# EAGLE board Mk3 Prototype2 (EAGLE 6.6.0), part 1 of 2
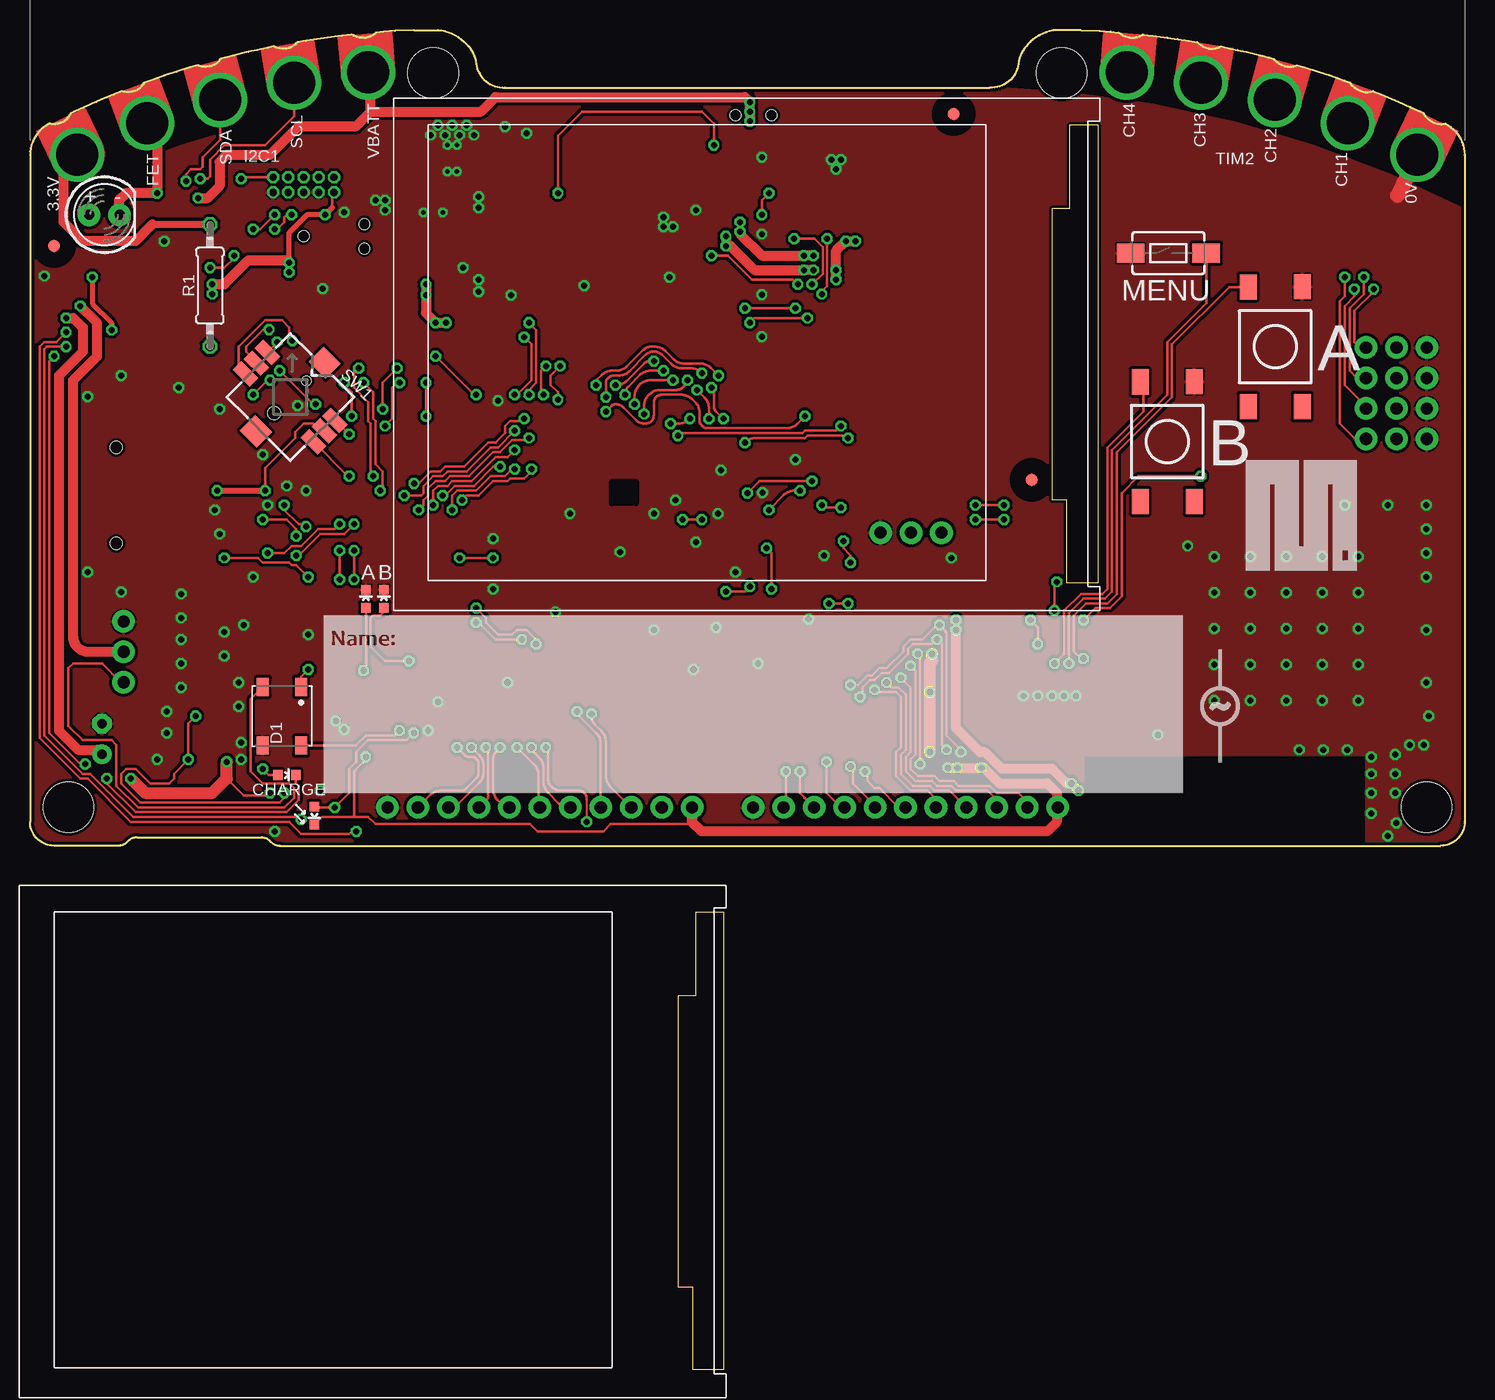
[diagram p2: board, top side]
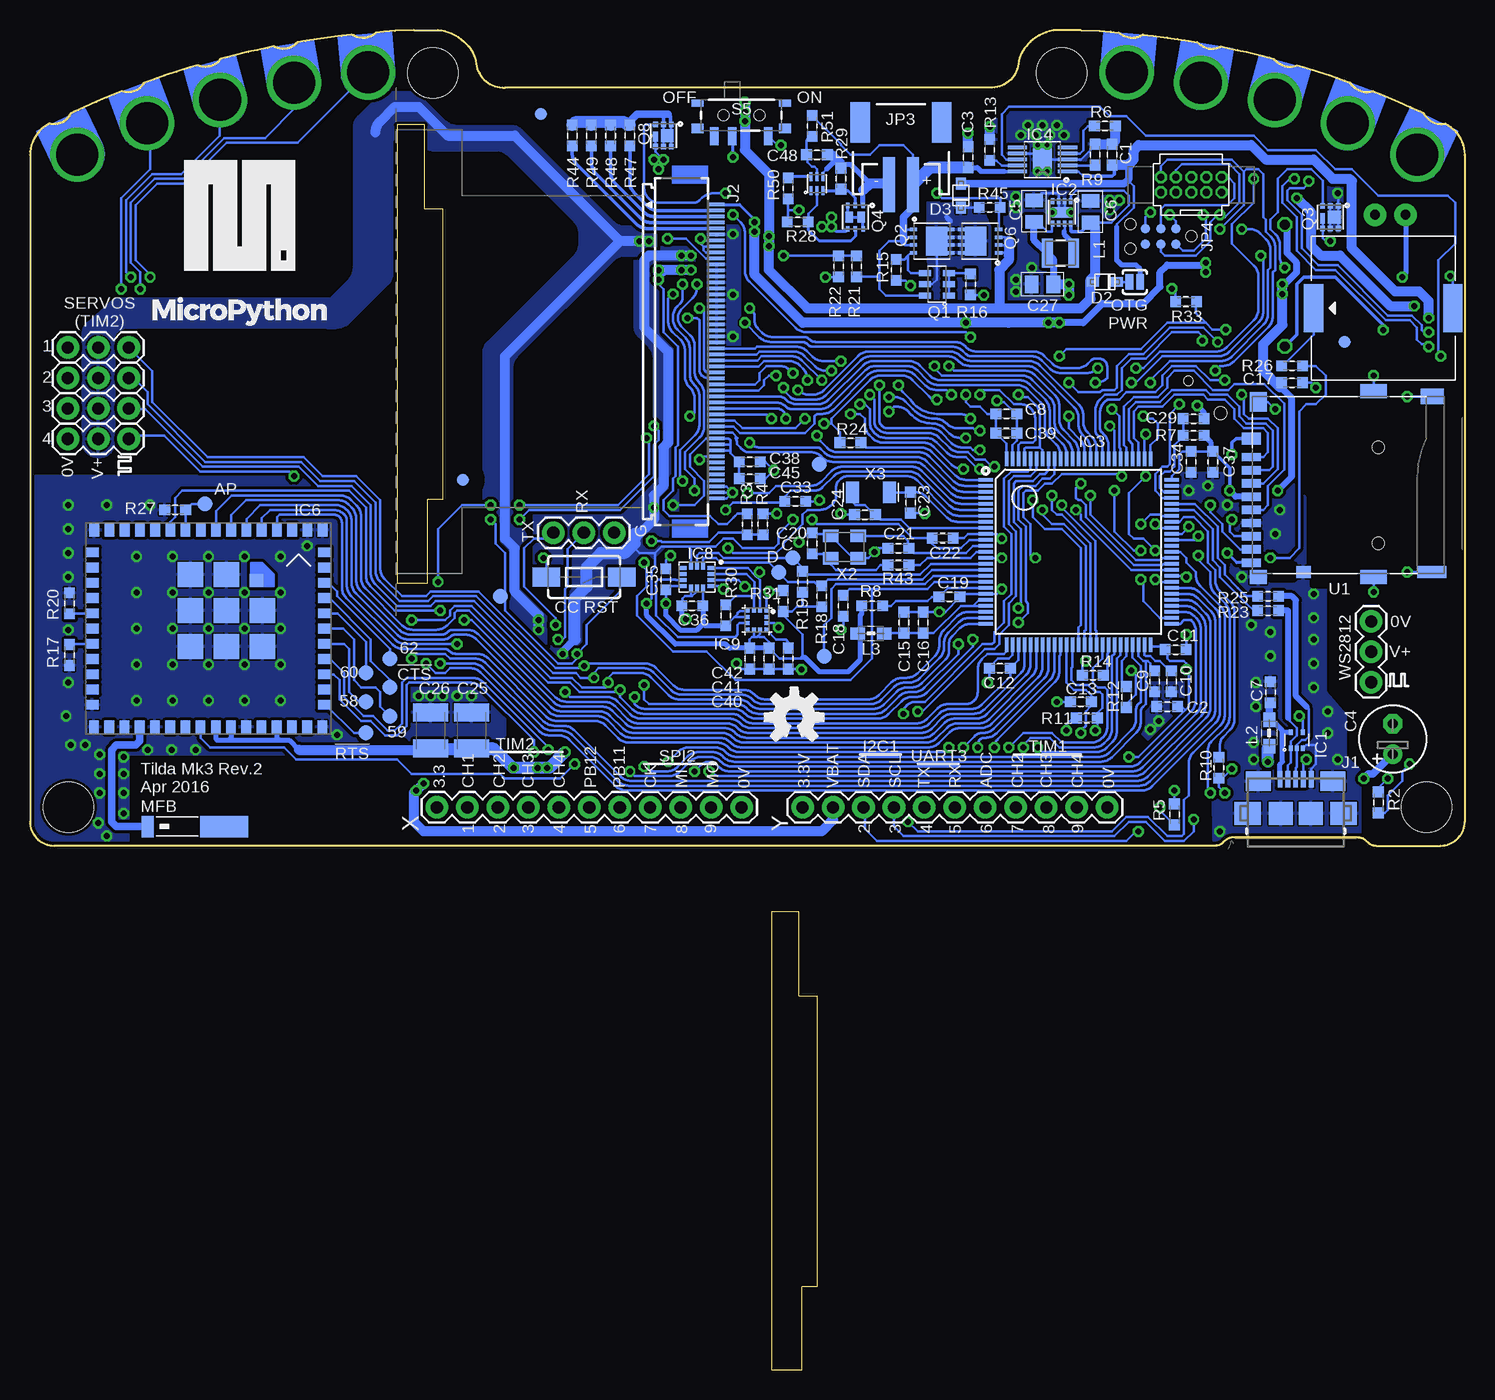
[diagram p3: board, bottom side, seen from below]

Size 119.6 x 111.7 mm. Coordinates in mm from the lower left corner, seen from the top.
Copper layers (1*16): Top 0.035mm / dielectric 1.4mm / Bottom 0.035mm
Design rules "TiLDA Mk3 DRC Rules *": minimum track width 0.15mm, minimum drill 15mil, track to track 0.15mm, track to pad 0.15mm, pad to pad 0.15mm, via to via 0.15mm, smd to smd 0.05mm, copper to edge 0.2mm, drill to drill 11mil, minimum pad ring 8mil, minimum via ring 8mil, stop-mask expansion 2mil, vias tented up to drill 25mil, thermal gap 0.15mm
Net classes: 0 default: width 0.15 mm, drill 0.3 mm; 1 ANT: width 1.27 mm, drill 0.4 mm, clearance 0.4 mm; 2 90R: width 0.5 mm, drill 0.3 mm, clearance 0.7 mm to class 0, clearance 0.1 mm; 3 100R: width 0.15 mm, drill 0.3 mm, clearance 0.6 mm to class 2, clearance 0.4 mm; 4 5V0: width 0.406 mm, drill 0.3 mm, clearance 0.6 mm to class 2, clearance 0.6 mm to class 3; 5 3V3: width 0.254 mm, drill 0.3 mm, clearance 0.6 mm to class 2, clearance 0.6 mm to class 3; 6 1V8: width 0.254 mm, drill 0.3 mm, clearance 0.6 mm to class 2, clearance 0.6 mm to class 3; 7 H5V0: width 0.254 mm, drill 0.3 mm, clearance 0.6 mm to class 2, clearance 0.6 mm to class 3; 8 MAINS: clearance 4 mm to class 0, clearance 4 mm to class 1, clearance 4 mm to class 2, clearance 4 mm to class 3, clearance 4 mm to class 4, clearance 4 mm to class 5, clearance 4 mm to class 6, clearance 4 mm to class 7, clearance 4 mm
tRestrict: area 48.8,113.3 to 52.8,117.3

## Footprints (pad centres in the part's own frame; a part is rotated, then mirrored left to right if it is on the bottom)
2450AT42A100 = smd 1 x 1.8: P$1 -0.5,0 | smd 4 x 1.8: P$2 5.9,0
C0603K-SMALL = smd 0.889 x 0.889: 1 -0.875,0; 2 0.875,0
E2,5-6 = drill 0.813 pad 1.6: + -1.27,0 | drill 0.813 pad 1.6 octagon: - 1.27,0
C0805-N = smd 1.15 x 1.45: 1 -0.9,0; 2 0.9,0
C1210K = smd 1.5 x 2.9: 1 -1.5,0; 2 1.5,0
WS2812B = smd 1.5 x 1: 1 -2.45,1.6; 2 -2.45,-1.6; 3 2.45,-1.6; 4 2.45,1.6
SOD-323F = smd 1 x 0.8: A -1,0; C 1,0
FIDUCIAL-1X2.5-STOP = smd 1 x 1: 1 0,0
DRL-5 = smd 0.3 x 0.45: 1 -0.5,-0.675; 2 0,-0.675; 3 0.5,-0.675; 4 0.5,0.675; 5 -0.5,0.675
WSON8 = smd 0.28 x 0.5: 1 -0.75,-0.95; 2 -0.25,-0.95; 3 0.25,-0.95; 4 0.75,-0.95; 5 0.75,0.95; 6 0.25,0.95; 7 -0.25,0.95; 8 -0.75,0.95 | smd 1.6 x 0.9: EP 0,0
TQFP100 = smd 0.3 x 1.2: 1 -6,-7.75; 2 -5.5,-7.75; 3 -5,-7.75; 4 -4.5,-7.75; 5 -4,-7.75; 6 -3.5,-7.75; 7 -3,-7.75; 8 -2.5,-7.75; 9 -2,-7.75; 10 -1.5,-7.75; 11 -1,-7.75; 12 -0.5,-7.75; 13 0,-7.75; 14 0.5,-7.75; 15 1,-7.75; 16 1.5,-7.75; 17 2,-7.75; 18 2.5,-7.75; 19 3,-7.75; 20 3.5,-7.75; 21 4,-7.75; 22 4.5,-7.75; 23 5,-7.75; 24 5.5,-7.75; 25 6,-7.75; 51 6,7.75; 52 5.5,7.75; 53 5,7.75; 54 4.5,7.75; 55 4,7.75; 56 3.5,7.75; 57 3,7.75; 58 2.5,7.75; 59 2,7.75; 60 1.5,7.75; 61 1,7.75; 62 0.5,7.75; 63 0,7.75; 64 -0.5,7.75; 65 -1,7.75; 66 -1.5,7.75; 67 -2,7.75; 68 -2.5,7.75; 69 -3,7.75; 70 -3.5,7.75; 71 -4,7.75; 72 -4.5,7.75; 73 -5,7.75; 74 -5.5,7.75; 75 -6,7.75 | smd 1.2 x 0.3: 26 7.75,-6; 27 7.75,-5.5; 28 7.75,-5; 29 7.75,-4.5; 30 7.75,-4; 31 7.75,-3.5; 32 7.75,-3; 33 7.75,-2.5; 34 7.75,-2; 35 7.75,-1.5; 36 7.75,-1; 37 7.75,-0.5; 38 7.75,0; 39 7.75,0.5; 40 7.75,1; 41 7.75,1.5; 42 7.75,2; 43 7.75,2.5; 44 7.75,3; 45 7.75,3.5; 46 7.75,4; 47 7.75,4.5; 48 7.75,5; 49 7.75,5.5; 50 7.75,6; 76 -7.75,6; 77 -7.75,5.5; 78 -7.75,5; 79 -7.75,4.5; 80 -7.75,4; 81 -7.75,3.5; 82 -7.75,3; 83 -7.75,2.5; 84 -7.75,2; 85 -7.75,1.5; 86 -7.75,1; 87 -7.75,0.5; 88 -7.75,0; 89 -7.75,-0.5; 90 -7.75,-1; 91 -7.75,-1.5; 92 -7.75,-2; 93 -7.75,-2.5; 94 -7.75,-3; 95 -7.75,-3.5; 96 -7.75,-4; 97 -7.75,-4.5; 98 -7.75,-5; 99 -7.75,-5.5; 100 -7.75,-6
HVSSOP10 = smd 0.3 x 1.6: 1 -1,-2.1; 2 -0.5,-2.1; 3 0,-2.1; 4 0.5,-2.1; 5 1,-2.1; 6 1,2.1; 7 0.5,2.1; 8 0,2.1; 9 -0.5,2.1; 10 -1,2.1 | smd 1.88 x 1.57: EP 0,0
CC3100MOD = smd 0.81 x 1.09: 1 0,0; 2 1.27,0; 3 2.54,0; 4 3.81,0; 5 5.08,0; 6 6.35,0; 7 7.62,0; 8 8.89,0; 9 10.16,0; 10 11.43,0; 11 12.7,0; 12 13.97,0; 13 15.24,0; 14 16.51,0; 15 17.78,0; 16 19.05,0; 28 19.07,16.4; 29 17.8,16.4; 30 16.53,16.4; 31 15.26,16.4; 32 13.99,16.4; 33 12.72,16.4; 34 11.45,16.4; 35 10.18,16.4; 36 8.91,16.4; 37 7.64,16.4; 38 6.37,16.4; 39 5.1,16.4; 40 3.83,16.4; 41 2.56,16.4; 42 1.29,16.4; 43 0.02,16.4 | smd 1.09 x 0.81: 17 19.2,1.85; 18 19.2,3.12; 19 19.2,4.39; 20 19.2,5.66; 21 19.2,6.93; 22 19.2,8.2; 23 19.2,9.47; 24 19.2,10.74; 25 19.2,12.01; 26 19.2,13.28; 27 19.2,14.55; 44 -0.15,14.55; 45 -0.15,13.28; 46 -0.15,12.01; 47 -0.15,10.74; 48 -0.15,9.47; 49 -0.15,8.2; 50 -0.15,6.93; 51 -0.15,5.66; 52 -0.15,4.39; 53 -0.15,3.12; 54 -0.15,1.85 | smd 1.1 x 1.1: 55 5.52,4.195 | smd 2.11 x 2.11: 56 8.02,3.695; 57 11.02,3.695; 58 5.02,6.695; 59 8.02,6.695; 60 11.02,6.695; 61 5.02,9.695; 62 8.02,9.695; 63 11.02,9.695
WSON-6 = smd 0.28 x 0.75: 1 -0.5,-0.575; 2 0,-0.575; 3 0.5,-0.575; 4 0.5,0.575; 5 0,0.575; 6 -0.5,0.575
LGA14 = smd 0.55 x 0.33: 1 1.15,0.75; 2 1.15,0.25; 3 1.15,-0.25; 4 1.15,-0.75; 8 -1.15,-0.75; 9 -1.15,-0.25; 10 -1.15,0.25; 11 -1.15,0.75 | smd 0.33 x 0.55: 5 0.5,-0.9; 6 0,-0.9; 7 -0.5,-0.9; 12 -0.5,0.9; 13 0,0.9; 14 0.5,0.9
LGA12 = smd 0.33 x 0.33: 1 0.782,0.782; 2 0.782,0.25; 3 0.782,-0.25; 4 0.782,-0.782; 5 0.25,-0.782; 6 -0.25,-0.782; 7 -0.782,-0.782; 8 -0.782,-0.25; 9 -0.782,0.25; 10 -0.782,0.782; 11 -0.25,0.782; 12 0.25,0.782
USB-AB-MICRO-SMD_LWK = smd 1.4 x 0.4: D+ 2.85,0; D- 2.85,0.65; GND 2.85,-1.3; ID 2.85,-0.65; VBUS 2.85,1.3 | smd 1.6 x 2.1: SHIELD 2.675,3.1; SHIELD@5 2.675,-3.1 | smd 1.9 x 2: SHIELD@0 0,1.25; SHIELD@1 0,-1.25 | smd 1.9 x 2.2: SHIELD@2 0,-4; SHIELD@3 0,4
FH12-50S-0.5SH = smd 0.3 x 1.3: 1 -12.25,3.25; 2 -11.75,3.25; 3 -11.25,3.25; 4 -10.75,3.25; 5 -10.25,3.25; 6 -9.75,3.25; 7 -9.25,3.25; 8 -8.75,3.25; 9 -8.25,3.25; 10 -7.75,3.25; 11 -7.25,3.25; 12 -6.75,3.25; 13 -6.25,3.25; 14 -5.75,3.25; 15 -5.25,3.25; 16 -4.75,3.25; 17 -4.25,3.25; 18 -3.75,3.25; 19 -3.25,3.25; 20 -2.75,3.25; 21 -2.25,3.25; 22 -1.75,3.25; 23 -1.25,3.25; 24 -0.75,3.25; 25 -0.25,3.25; 26 0.25,3.25; 27 0.75,3.25; 28 1.25,3.25; 29 1.75,3.25; 30 2.25,3.25; 31 2.75,3.25; 32 3.25,3.25; 33 3.75,3.25; 34 4.25,3.25; 35 4.75,3.25; 36 5.25,3.25; 37 5.75,3.25; 38 6.25,3.25; 39 6.75,3.25; 40 7.25,3.25; 41 7.75,3.25; 42 8.25,3.25; 43 8.75,3.25; 44 9.25,3.25; 45 9.75,3.25; 46 10.25,3.25; 47 10.75,3.25; 48 11.25,3.25; 49 11.75,3.25; 50 12.25,3.25
SWD_PTH_SHROUD = drill 0.6 octagon: 1 -2.54,-0.635; 2 -2.54,0.635; 3 -1.27,-0.635; 4 -1.27,0.635; 5 0,-0.635; 6 0,0.635; 7 1.27,-0.635; 8 1.27,0.635; 9 2.54,-0.635; 10 2.54,0.635
1X11 = drill 1.016 pad 1.88: 1 0,0; 2 2.54,0; 3 5.08,0; 4 7.62,0; 5 10.16,0; 6 12.7,0; 7 15.24,0; 8 17.78,0; 9 20.32,0; 10 22.86,0; 11 25.4,0
JST-2-SMD = smd 1 x 4.6: 1 -1,-3.7; 2 1,-3.7 | smd 1.6 x 3.4: NC1 -3.4,1.5; NC2 3.4,1.5
TC2030-MCP-NL = smd 0.787 x 0.787: 1 1.27,-0.635; 2 1.27,0.635; 3 2.54,-0.635; 4 2.54,0.635; 5 3.81,-0.635; 6 3.81,0.635 | hole 0.889: 0,0; 5.08,-1.016; 5.08,1.016
1008 = smd 0.9 x 2.4: 1 -1.1,0; 2 1.1,0
WUERTH-0805 = smd 1.2 x 1: 1 -1.1,0; 2 1.1,0
LED5MM = drill 0.813 pad 1.88: A -1.27,0; K 1.27,0
LED-0603-CORRECT = smd 0.8 x 0.8: A 0.75,0; C -0.75,0
TILDA_MKE_OUTLINE = drill 3.5: 3V3 3.944,57.614; CH1 91.417,64.462; CH2 97.598,63.614; CH3 103.762,62.167; CH4 109.842,60.229; FET 9.758,60.229; GND 115.656,57.614; SCL 22.002,63.614; SDA 15.838,62.167; VBATT 28.183,64.462 | hole 4.2: 33.6,64.4; 86,64.4; 3.2,3.2; 116.4,3.2
SOT26 = smd 0.5 x 1: 1 -0.95,-1; 2 0,-1; 3 0.95,-1; 4 0.95,1; 5 0,1; 6 -0.95,1
Q3A = smd 0.3 x 0.6: 1 -0.975,-1.55; 2 -0.325,-1.55; 3 0.325,-1.55; 4 0.975,-1.55; 5 0.975,1.55; 6 0.325,1.55; 7 -0.325,1.55; 8 -0.975,1.55 | smd 2.45 x 1.775: EP 0,0.375
Q2 = smd 0.4 x 0.455: 1 -0.65,-0.922; 2 0,-0.922; 3 0.65,-0.922; 4 0.65,0.922; 5 0,0.922; 6 -0.65,0.922 | smd 1.05 x 1.1: EP1 -0.325,0 | smd 0.4 x 0.85: EP2 0.65,0.1
Q2_DUAL = smd 0.3 x 0.45: 1 -0.65,-0.975; 2 0,-0.975; 3 0.65,-0.975; 4 0.65,0.975; 5 0,0.975; 6 -0.65,0.975 | smd 0.625 x 0.9: EP1 -0.488,0; EP2 0.488,0
0207/10 = drill 0.813 octagon: 1 -5.08,0; 2 5.08,0
TACTILE_SWITCH_TALL = smd 2.1 x 1.4: A1 -5,-2.25; A2 5,-2.25; B1 -5,2.25; B2 4.975,2.25
SWITCH-SPST-SMD-A = smd 0.7 x 1.5: 1 -2.25,-1.75; 2 -0.75,-1.75; 3 2.25,-1.75 | smd 1 x 0.6: GND1 -3.65,1; GND3 3.65,1 | smd 1 x 0.8: GND2 -3.65,-1.1; GND4 3.65,-1.1 | hole 0.9: -1.5,0; 1.5,0
TACTILE-SWITCH-1101NE = smd 2.3 x 1.6: 1 -3.15,0; 2 3.15,0
BUZZER-PKLCS1212E = smd 1.6 x 4: P$1 -5.8,0; P$2 5.8,0
PAD-JUMPER-2-NO_YES_SILK = smd 0.635 x 1.27: 1 -0.45,0; 2 0.45,0
1X03 = drill 1.016 pad 1.88: 1 0,0; 2 2.54,0; 3 5.08,0
JOYSTICK_MULTICOMP = smd 2 x 1: A -4,1.275; B 4,1.275; C -4,-1.275; COM 4,0; CTR -4,0; D 4,-1.275 | smd 2 x 1.8: NC 0,4.05; NC@0 0,-4.05 | hole 0.75: 0,1.9 | hole 1.05: 0,-1.9
B1,27 = smd 1.27 x 1.27: TP 0,0
DM3AT_0011 = smd 0.7 x 1.6: 1 -0.8,10.6; 2 -1.9,10.6; 3 -3,10.6; 4 -4.1,10.6; 5 -5.2,10.6; 6 -6.3,10.6; 7 -7.4,10.6; 8 -8.5,10.6; CD -9.6,10.6 | smd 1.2 x 1.4: GND -10.8,10 | smd 1.6 x 1.4: GND1 3.8,10 | smd 1.2 x 2.2: GND2 -10.8,0.4; GND3 4.7,0.4 | smd 1 x 1.6: GND4 0.75,10.6 | smd 1 x 2.4: GND5 -10.4,-4.45 | smd 1 x 1.2: GND6 -10.4,6.25 | smd 1.3 x 1.9: GND7 4.25,-4.5 | hole 1: 0,0; -8,0
CRYSTAL-3.2-2.5 = smd 1.3 x 1.05: 1 -1.15,-0.925; 2 1.15,-0.925; 3 1.15,0.925; 4 -1.15,0.925
RESONATOR_EPSON_FC_145 = smd 1.1 x 1.8: P$1 -1.55,0; P$2 1.55,0

## Placement (x,y rotation side)
ANT1  CHIPANT  [2450AT42A100]  109.3,45.3 0 bottom
C1  0603/2u2/10V/X5R  [C0603K-SMALL]  29.4,101.3 270 bottom
C2  0603/1u/10V/X5R  [C0603K-SMALL]  24.8,55.3 0 bottom
C3  0603/2u2/10V/X5R  [C0603K-SMALL]  41.4,101.1 270 bottom
C4  DNP (OTG)  [E2,5-6]  6,52.6 90 bottom
C5  0805/10u/10V/X5R  [C0805-N]  35.9,96.6 90 bottom
C6  0805/10u/10V/X5R  [C0805-N]  31.2,96.55 90 bottom
C7  0603/100n/10V/X5R  [C0603K-SMALL]  16.2,56.5 270 bottom
C8  0603/4u7/10V/X5R  [C0603K-SMALL]  38.2,79.7 180 bottom
C9  0603/2.2u/6.3V/X5R or DNP  [C0603K-SMALL]  25.85,57.4 90 bottom
C10  0603/0R  [C0603K-SMALL]  24.45,57.4 90 bottom
C11  0603/100n/10V/X5R  [C0603K-SMALL]  24.1,60.05 180 bottom
C12  0603/100n/10V/X5R  [C0603K-SMALL]  38.75,58.5 0 bottom
C13  0603/1u/10V/X5R  [C0603K-SMALL]  32,55.7 0 bottom
C15  0603/10n/25V/X7R  [C0603K-SMALL]  46.75,62.3 270 bottom
C16  0603/100n/10V/X5R  [C0603K-SMALL]  45.15,62.3 270 bottom
C17  0603/4u7/10V/X5R  [C0603K-SMALL]  14.4,82.3 180 bottom
C18  0603/1u/10V/X5R  [C0603K-SMALL]  51.8,63.7 90 bottom
C19  0603/100n/10V/X5R or 0 ohm  [C0603K-SMALL]  42.95,64.45 180 bottom
C20  DNP (0603/10p/50V/NP0)  [C0603K-SMALL]  54.4,68.9 270 bottom
C21  DNP (0603/10p/50V/NP0)  [C0603K-SMALL]  47.2,68.5 0 bottom
C22  0603/100n/10V/X5R  [C0603K-SMALL]  43.51,69.35 180 bottom
C23  0603/10p/50V/NP0  [C0603K-SMALL]  46.2,72.3 90 bottom
C24  0603/10p/50V/NP0  [C0603K-SMALL]  50,71.3 0 bottom
C25  1210/100u/20%  [C1210K]  82.8,53.3 90 bottom
C26  1210/100u/20%  [C1210K]  86.2,53.3 90 bottom
C27  0805/10u/10V/X5R  [C0805-N]  35.2,90.5 180 bottom
C29  0603/2.2u/6.3V/X5R  [C0603K-SMALL]  22.6,79.3 180 bottom
C33  0603/1u/10V/X5R  [C0603K-SMALL]  55.8,72.4 180 bottom
C34  0603/100n/10V/X5R  [C0603K-SMALL]  22.8,75.7 90 bottom
C35  0603/100n/10V/X5R  [C0603K-SMALL]  66.6,65.9 90 bottom
C36  0603/100n/10V/X5R  [C0603K-SMALL]  64.4,63.7 180 bottom
C37  0603/4u7/10V/X5R  [C0603K-SMALL]  21,75.7 90 bottom
C38  0603/4u7/10V/X5R  [C0603K-SMALL]  59.6,75.7 180 bottom
C39  0603/100n/10V/X5R  [C0603K-SMALL]  38.2,78.1 180 bottom
C40  0603/100n/10V/X5R  [C0603K-SMALL]  56.4,59.3 270 bottom
C41  0603/100n/10V/X5R  [C0603K-SMALL]  58,59.3 270 bottom
C42  0603/1u/10V/X5R  [C0603K-SMALL]  59.6,59.3 270 bottom
C45  0603/100n/10V/X5R  [C0603K-SMALL]  59.6,74.3 180 bottom
C48  0603/100n/10V/X5R  [C0603K-SMALL]  54,101.3 180 bottom
D1  WS2812B  [WS2812B]  21,54.5 270 top
D2  [SOD-323F]  30,90.7 0 bottom
D3  [SOD-323F]  42,97.9 270 bottom
FID1  FIDUCIAL1X2.5-STOP  [FIDUCIAL-1X2.5-STOP]  77,104.7 90 top
FID2  FIDUCIAL1X2.5-STOP  [FIDUCIAL-1X2.5-STOP]  83.5,74.2 0 top
FID3  FIDUCIAL1X2.5-STOP  [FIDUCIAL-1X2.5-STOP]  2,93.7 0 top
FID4  FIDUCIAL1X2.5-STOP  [FIDUCIAL-1X2.5-STOP]  10,85.7 0 bottom
FID5  FIDUCIAL1X2.5-STOP  [FIDUCIAL-1X2.5-STOP]  83.5,74.2 0 bottom
FID6  FIDUCIAL1X2.5-STOP  [FIDUCIAL-1X2.5-STOP]  77,104.7 90 bottom
IC1  TPD3E001DRL  [DRL-5]  14,52.5 0 bottom
IC2  TPS62082  [WSON8]  33.6,96.5 180 bottom
IC3  STM32F401V  [TQFP100]  32.2,68.2 270 bottom
IC4  BQ24092  [HVSSOP10]  35.2,100.9 90 bottom
IC6  CC3100MOD  [CC3100MOD]  95.2,70 180 bottom
IC7  BQ2970  [WSON-6]  54,98.9 0 bottom
IC8  LSM6DS3  [LGA14]  64,66.1 0 bottom
IC9  LIS3MDL  [LGA12]  59,62.5 0 bottom
J1  ZX62-AB-5PA(11)  [USB-AB-MICRO-SMD_LWK]  14.1,46.4 90 bottom
J2  ER-CON50HT-1  [FH12-50S-0.5SH]  65.6,84.9 270 bottom
J3  SWD_SHROUD  [SWD_PTH_SHROUD]  22.8,98.8 0 bottom
JP1  M11PTH  [1X11]  85.68,46.9 0 bottom
JP2  M11PTH  [1X11]  55.2,46.9 0 bottom
JP3  [JST-2-SMD]  47,102.5 0 bottom
JP4  TC2030-SWDNL  [TC2030-MCP-NL]  22.8,94.5 180 bottom
L1  SRN2512-2R2M  [1008]  33.7,93.1 180 bottom
L2  Bead  [WUERTH-0805]  16.3,53.1 270 bottom
L3  Bead  [WUERTH-0805]  49.5,61.4 0 bottom
LED1  DNP  [LED5MM]  6.2,96.3 0 top
LED2  RED  [LED-0603-CORRECT]  28,64.3 270 top
LED3  GREEN  [LED-0603-CORRECT]  29.5,64.3 270 top
LED4  RED  [LED-0603-CORRECT]  23.7,46.2 90 top
LED5  RED  [LED-0603-CORRECT]  21.4,49.6 180 top
LOGO1  OSHW-LOGOM  [OSHW-LOGO-M]  55.9,54.4 0 bottom
LOGO2  MICROPYTHON-SILK  [UPYTHON_LOGO_SLIKONLY]  97.2,91.6 0 top
LOGO3  MICROPYTHON-STOP  [UPYTHON_LOGO_STOPONLY]  110.9,66.6 0 bottom
OUTLINE1  TILDA_MK3_BOARDOUTLINE  [TILDA_MKE_OUTLINE]  0,43.7 0 top
Q1  DMMT5401  [SOT26]  44,90.5 90 bottom
Q2  CSD25402Q3A  [Q3A]  44.4,94.1 270 bottom
Q3  CSD13202Q2  [Q2]  11.2,96.1 180 bottom
Q4  CSD85301Q2  [Q2_DUAL]  50.8,96.1 180 bottom
Q6  CSD25402Q3A  [Q3A]  40.4,94.1 90 bottom
Q8  CSD13202Q2  [Q2]  66.8,102.9 180 bottom
R1  DNP  [0207/10]  15,90.4 90 top
R2  0603/330/5%  [C0603K-SMALL]  7.2,47.3 90 bottom
R3  0603/220k/5%  [C0603K-SMALL]  59.8,70.5 270 bottom
R4  0603/220k/5%  [C0603K-SMALL]  58.5,70.5 90 bottom
R5  0603/2M2/5%  [C0603K-SMALL]  24.2,46.3 90 bottom
R6  0603/2k/5%  [C0603K-SMALL]  30,103.7 0 bottom
R7  DNP or 0  [C0603K-SMALL]  22.6,77.9 180 bottom
R8  DNP or 0  [C0603K-SMALL]  49.4,63.7 180 bottom
R9  0603/1k/5%  [C0603K-SMALL]  30.8,101.3 90 bottom
R10  0603/0R  [C0603K-SMALL]  20.5,50.2 270 bottom
R11  DNP / 0603/100K/5%  [C0603K-SMALL]  31.5,54.35 0 bottom
R12  0603/150/5%  [C0603K-SMALL]  28.2,56.1 90 bottom
R13  0603/10k/5%  [C0603K-SMALL]  39.6,101.7 90 bottom
R14  0603/120/5%  [C0603K-SMALL]  31,57.9 0 bottom
R15  0603/47k/5%  [C0603K-SMALL]  47.4,91.7 270 bottom
R16  0603/10k/5%  [C0603K-SMALL]  41.2,90.5 270 bottom
R17  0603/10k/5%  [C0603K-SMALL]  116.3,59.6 270 bottom
R18  DNP (0603/10k/5%)  [C0603K-SMALL]  53.6,64.5 90 bottom
R19  DNP (0603/10k/5%)  [C0603K-SMALL]  55.2,65.7 90 bottom
R20  0603/220k/5%  [C0603K-SMALL]  116.3,63.9 90 bottom
R21  0603/470k/5%  [C0603K-SMALL]  50.7,92 270 bottom
R22  0603/470k/5%  [C0603K-SMALL]  52.2,92 270 bottom
R23  0603/0R  [C0603K-SMALL]  16.4,63.3 0 bottom
R24  0603/330/5%  [C0603K-SMALL]  51.2,77.3 0 bottom
R25  0603/0R  [C0603K-SMALL]  16.4,64.5 0 bottom
R26  0603/120/5%  [C0603K-SMALL]  14.4,83.7 0 bottom
R27  0603/220k/5%  [C0603K-SMALL]  107.5,71.7 180 bottom
R28  0603/4M7/5%  [C0603K-SMALL]  55.6,95.7 180 bottom
R29  0603/4M7/5%  [C0603K-SMALL]  52,99.3 90 bottom
R30  DNP (0603/10k/5%)  [C0603K-SMALL]  61.6,62.9 90 bottom
R31  DNP (0603/10k/5%)  [C0603K-SMALL]  56.8,64.1 90 bottom
R33  0603/47k/5%  [C0603K-SMALL]  23.24,89.05 0 bottom
R43  DNP (0603/150/5%)  [C0603K-SMALL]  47.2,67.1 180 bottom
R44  0603/4R7/5%  [C0603K-SMALL]  74.4,102.9 270 bottom
R45  0603/220k/5%  [C0603K-SMALL]  39.6,96.9 0 bottom
R47  0603/4R7/5%  [C0603K-SMALL]  69.6,102.9 270 bottom
R48  0603/4R7/5%  [C0603K-SMALL]  71.2,102.9 270 bottom
R49  0603/4R7/5%  [C0603K-SMALL]  72.8,102.9 270 bottom
R50  0603/2k/5%  [C0603K-SMALL]  56.4,98.5 270 bottom
R51  0603/330/5%  [C0603K-SMALL]  54.4,103.7 90 bottom
S3  1217769  [TACTILE_SWITCH_TALL]  103.8,85.3 90 top
S4  1217769  [TACTILE_SWITCH_TALL]  94.8,77.4 90 top
S5  Power Switch  [SWITCH-SPST-SMD-A]  60.3,104.6 0 bottom
S7  SWITCH-MOMENTARY-2SMD-1101NE  [TACTILE-SWITCH-1101NE]  94.9,93.1 0 top
S8  DNP  [TACTILE-SWITCH-1101NE]  73.4,66.1 180 bottom
SG1  BUZZER-PKLCS1212E  [BUZZER-PKLCS1212E]  6.8,88.5 0 bottom
SJ1  JUMPER-PAD-2-NOYES_SILK  [PAD-JUMPER-2-NO_YES_SILK]  27.5,90.7 0 bottom
SV2  [1X03]  7.8,62.4 270 bottom
SV3  [1X03]  116.45,85.23 0 bottom
SV4  [1X03]  116.45,77.61 0 bottom
SV5  [1X03]  116.45,82.69 0 bottom
SV6  [1X03]  116.45,80.15 0 bottom
SV7  [1X03]  70.9,69.8 180 bottom
SW1  JOYSTICK_MINI_MULTICOMP  [JOYSTICK_MULTICOMP]  21.7,81.1 315 top
TP1  TPB1,27  [B1,27]  53.4,59.5 0 bottom
TP11  TPB1,27  [B1,27]  105,72.2 0 bottom
TP12  TPB1,27  [B1,27]  89.6,56.9 0 bottom
TP13  TPB1,27  [B1,27]  91.6,53.1 0 bottom
TP14  TPB1,27  [B1,27]  91.6,55.7 0 bottom
TP15  TPB1,27  [B1,27]  89.6,54.5 0 bottom
TP16  TPB1,27  [B1,27]  91.6,58.1 0 bottom
TP17  TPB1,27  [B1,27]  89.6,59.3 0 bottom
TP18  TPB1,27  [B1,27]  57.2,66.5 0 bottom
TP19  TPB1,27  [B1,27]  56,67.7 0 bottom
TP20  TPB1,27  [B1,27]  80.4,64.5 0 bottom
TP21  TPB1,27  [B1,27]  53.8,75.5 0 bottom
U1  USD-SOCKET-SDIODM3AT_0011  [DM3AT_0011]  7.2,76.9 90 bottom
U2  ER-TFT024-3  [ER-TFT024-3]  4,-2.3 0 top
U$1  [NAME_AREA]  24.62,62.83 0 top
U$2  ER-TFT024-3  [ER-TFT024-3]  35.2,63.3 0 top
U$5  [EMFLOGO1]  99.2,55.3 0 top
X2  DNP (16MHz-3.2-2.5)  [CRYSTAL-3.2-2.5]  51.7,68.6 0 bottom
X3  ABS07-32.768KHZ-T  [RESONATOR_EPSON_FC_145]  49.5,73.15 180 bottom

## Tracks (layer width: path | path; a pad name or v marks a point on that pad's centre or on a via)
+3V3  (via drill 0.5)
  Top 0.2: v41.6,81.3 41.6,81.7 42.2,82.3 42.2,86.7 v41.6,87.3 | 25.2,96.9 25.2,98.03 J3.1 | v66,72.1 66.2,71.9 v67.6,71.9 | D1.1 22.6,57.8 v23.2,58.4 | v59.2,95.7 v59.2,94.9 | 27,46.1 27,49.9 28,50.9 v28,51.1 | v54.4,70.9 v56,70.9 | 27,46.1 24.35,46.1 LED4.C | 55.2,45.9 54.8,45.5 48.4,45.5 47.8,44.9 42.3,44.9 41.7,45.5 28.8,45.5 28.2,46.1 27,46.1 | SW1.COM 24.23,78.27 23.6,78.9 22.8,78.9 22.1,78.2 22.1,77.7 19.6,75.2 v19.6,73.3 | v66.6,63.9 v68.2,63.9
  Top 0.406: 25.2,96.9 v24.6,96.3 23.1,96.3 21.6,94.8 v21.6,92.3
  Top 0.5: v15.6,73.3 v19.6,73.3
  Top 0.6: v21.6,92.3 v21.6,91.5 | v15.2,89.7 v15.2,90.5 | 10.2,95.5 14.98,95.5 R1.2
  Top 0.813: v59.2,94.9 59.2,94.7 61,92.9 v64.5,92.9 v65.3,92.9 | v33,90.5 v33,89.6 33,88.1 v33.8,87.3 v34.7,87.3 | v76.5,50.2 v77.3,50.2 v79.3,50.2 79.5,50.2 80.8,48.9 84.8,48.9 85.6,48.1 85.6,46.98 JP1.1 85.6,46.9 85.6,45.7 84.8,44.9 56,44.9 55.2,45.7 55.2,45.9 JP2.1 | 10.2,95.5 8.8,94.1 4.4,94.1 2.8,95.7 2.8,100.27 3.94,100.27 OUTLINE1.3V3 | v15.2,90.5 16.2,90.5 18.2,92.5 21.4,92.5 v21.6,92.3
  Top 1: v75,56.5 75,58.9 75.2,59.1 v75.2,59.7
  Top 1.016: v75,51.5 v75,56.5
  Bottom 0.2: v41.6,87.3 38,87.3 | IC3.28 37.2,59.18 C12.2 37.88,57.83 40.23,55.47 arc45 41.13,55.1 42.87,55.1 arc-45 43.77,54.73 44.63,53.87 arc45 45.53,53.5 59.47,53.5 arc45 60.37,53.87 60.43,53.93 arc-45 61.33,54.3 68.67,54.3 arc45 69.57,54.67 70.63,55.73 arc-45 71.53,56.1 74.6,56.1 v75,56.5 | 20.93,76.58 C37.2 C34.2 23.52,76.58 23.8,76.3 23.8,75.1 24.4,74.5 24.4,74.25 IC3.75 | IC3.11 41.3,69.2 42,68.5 44,68.5 44.4,68.9 44.4,69.34 C22.2 46.05,69.35 47.2,70.5 54,70.5 v54.4,70.9 | IC3.100 38.2,77.22 C39.2 C8.2 39.8,79.7 40.4,80.3 41.2,80.3 41.6,80.7 v41.6,81.3 | 23.3,55 23,55.3 23,58.2 v23.2,58.4 23.2,58.9 23.4,59.1 24.6,59.1 24.8,59.3 24.8,59.88 C11.2 25.15,60.05 25.4,60.3 26.05,60.3 IC3.50 | 23.3,55 27.2,51.1 v28,51.1 | C2.2 23.6,55.3 23.3,55 | C45.2 C38.2 61.2,76.43 61.2,76.7 | 67.5,68.1 68.8,68.1 69.4,68.7 | v56,70.9 57.2,69.7 57.2,68.9 57.6,68.5 60.2,68.5 61,69.3 61.8,69.3 62.45,68.65 64.75,68.65 | IC2.5 34.4,95.5 34.4,94.9 34.8,94.9 35.6,95.7 C5.1 | 50.8,61.3 50.6,61.5 L3.1 | 61.2,77.1 61.2,77.5 61.35,77.65 J2.40 63.25,77.65 64.6,76.3 64.6,75.3 63.4,74.1 63.4,72.9 64.2,72.1 v66,72.1 | 61.2,77.1 61.2,76.7 | J2.42 61.25,76.65 61.2,76.7 | J2.41 61.25,77.15 61.2,77.1 | 67.5,68.1 67.5,66.9 67.8,66.6 67.8,64.3 v68.2,63.9 68,64.1 | JP4.1 24.07,95.77 v24.6,96.3 | 15.4,82.1 15.28,82.22 C17.2 15.4,82.18 15.4,81.9 | IC9.10 60.42,63.28 60.6,63.1 60.6,63.03 60.88,62.75 | IC9.5 58.75,61.35 58.9,61.2 | 58.9,61.2 59,61.1 59.2,61.1 | 59.2,61.1 59.4,61.1 59.6,60.9 C42.1 | IC9.6 59.25,61.15 59.2,61.1 | 58.9,61.2 58.8,61.1 58.4,61.1 58,60.7 C41.1 | 64.5,68.2 IC8.12 64.5,68.4 64.75,68.65
  Bottom 0.2: IC8.5 63.5,63.73 C36.1 | IC8.8 66.47,65.35 66.6,65.22 C35.1 v66.6,63.9 | IC9.9 60.88,62.75 | 60.88,62.75 R30.1 | C41.1 58,60.1 | R18.1 55.2,63.62 | 55.2,63.62 55.67,63.62 56.08,63.23 R31.1 56.8,62.9 55.2,61.3 55.2,59.4 55.2,59.3 57.12,59.3 C41.1 | R19.1 55.2,63.62 | 64.75,68.65 66.95,68.65 67.5,68.1
  Bottom 0.254: J2.1 60.45,97.15 59.2,95.9 v59.2,94.9
  Bottom 0.305: v19.6,73.3 19.6,75.2 20.98,76.58 C37.2 21.05,76.58 21.12,76.65
  Bottom 0.406: IC6.36 104.11,52.61 104,52.5 103,52.5 | 103,52.5 98.8,52.5 | 98.8,52.5 98,52.5 97.2,51.7 | IC6.37 102.84,52.66 103,52.5 | IC6.40 99.03,52.73 98.8,52.5 | 63.5,63.73 63.5,62.2 | v66.6,63.9 66.6,62.9 65.4,61.7 64,61.7 63.5,62.2 | R30.1 63.33,62.03 63.5,62.2 | C41.1 C42.1 61.27,60.18 61.6,60.5 65.8,60.5 68.2,62.9 v68.2,63.9 | R8.2 50.27,63.03 50.4,62.9 50.4,61.6 | 50.4,61.6 L3.1 | 21.12,76.65 21.12,77.3 R7.1 | 50.4,61.6 50.4,59.2 51.4,58.2 53.8,58.2 55,59.4 55.2,59.4
  Bottom 0.5: 14.43,74.47 v15.6,73.3 | U1.4 19.1,72.8 v19.6,73.3
  Bottom 0.6: v33.8,87.3 31.8,87.3 30.2,88.9 26.8,88.9 25.4,90.3 25.4,91.5 24.8,92.1 21.8,92.1 v21.6,92.3 | 14.43,74.47 14.43,81.03 15.4,82 15.4,82.1 | C17.2 15.28,81.83 | v15.2,90.5 15,90.5 14,91.5 14,92.3 14.8,93.1 14.8,95.28 R1.2 | C5.1 35.9,94.2 L1.2 34.3,92.6 C27.1
  Bottom 0.61: v75.2,59.7 75.2,59.9 74.2,60.9
  Bottom 0.813: v33.8,87.3 v34.7,87.3 38,87.3 55.2,87.3 59.2,91.3 v59.2,94.9 | 97.2,51.7 81.05,51.7 80.95,51.8 | C25.1 C26.1 | C27.1 v33,90.5 v33,89.6 | v15.2,90.5 15.2,87.1 16.8,85.5 16.8,83.3 15.4,81.9 | v64.5,92.9 v65.3,92.9 68,92.9 68.4,92.5 68.4,86.9 66.4,84.9 66.4,77.3 66.8,76.9 66.8,73.7 67.6,72.9 v67.6,71.9 67.6,70.9 69.2,69.3
  Bottom 1.016: v75,51.5 76.3,50.2 v79.3,50.2 79.35,50.2 80.95,51.8 C25.1 | 74.2,60.9 74.2,64.3 73.2,65.3 73.2,66.9 72,68.1 70,68.1 69.4,68.7 69.2,68.9 69.2,69.3 69.2,69.7
  pour Bottom (isolate 0.254, rank 2): 64.2,93.6 68,93.6 arc-90 69.2,92.4 69.2,87.03 arc-45 68.83,86.13 67.97,85.27 arc45 67.6,84.37 67.6,77.7 68,77.3 68,74.5 70.4,72.1 70.4,71.7 77.2,71.7 77.6,71.3 77.6,58.9 77.2,58.5 74.8,58.5 73.2,60.1 73.2,62.5 70.4,65.3 70,65.3 65.6,69.7 65.6,85.3 66.9,86.6 66.9,92.2 64.2,92.2
ADC_IN  (via drill 0.5)
  Top 0.2: v39.2,51.9 38.89,51.59 arc45 38.6,50.89 38.6,48.43 arc45 38.97,47.53 39.34,47.16 arc45 JP2.7
  Bottom 0.2: IC3.35 33.7,59.6 33.8,59.5 33.8,58.23 arc45 34.17,57.33 38.92,52.58 arc-45 v39.2,51.9
ADC_LIGHT  (via drill 0.5)
  Top 0.2: v32,53.1 31.4,52.5 28.2,52.5 27.2,51.5 27.2,50.7 26.6,50.1 26.6,48.1 v25.4,46.9 23.75,46.9 LED4.A
  Bottom 0.2: IC3.36 33.2,57.3 32.6,56.7 31.6,56.7 30.9,56 31.12,55.78 C13.2 31.2,55.62 31.2,55.3 31.6,54.9 31.6,53.7 31.86,53.44 arc-45 v32,53.1 | 24.2,45.3 R5.1 25.4,46.62 v25.4,46.9
ADC_VIN  (via drill 0.5)
  Top 0.2: v67.8,69.1 67.8,68.5 68.4,67.9 v68.4,67.3
  Bottom 0.2: R4.1 R3.2 59.98,69.8 62.2,69.8 63,69 66.9,69 67,69.1 v67.8,69.1 | IC3.18 44.2,65.7 44.8,65.1 49.4,65.1 | 49.4,65.1 51.27,65.1 C18.2 | 49.4,65.1 49.4,59.3 51.2,57.5 60.8,57.5 63.2,59.9 66,59.9 69,62.9 69,64.5 68.2,65.3 68.2,66.7 68.4,66.9 v68.4,67.3
BOOT0  (via drill 0.5)
  Top 0.2: v37.2,81.3 37,81.3 v33.8,84.5 | 19.75,86.88 19.86,86.88 19.92,86.83 v19.92,86.73 19.92,86.87 19.88,86.9 19.6,86.9 18,85.3 18,84.9 18.87,84.03 SW1.CTR
  Bottom 0.2: IC3.97 36.7,76.8 36.6,76.9 35.4,76.9 | IC3.94 35.2,76.7 35.4,76.9 | 35.4,76.9 35.4,79.57 arc-45 35.77,80.47 36.4,81.1 36.72,81.1 arc45 v37.2,81.3 | v19.92,86.73 21.03,86.73 21.6,87.3 | 21.6,87.3 22.4,88.1 22.4,89.02 R33.2 | 21.6,87.3 24.8,87.3 27,85.1 33.2,85.1 v33.8,84.5
BTN_MENU  (via drill 0.5)
  Top 0.2: v86.6,58.9 86.6,63.1 87.8,64.3 89.6,64.3 90.2,64.9 90.2,76.7 94.8,81.3 94.8,85.7 98.05,88.95 S7.2
  Bottom 0.2: v86.6,58.9 85.8,58.1 85,58.1 84.6,58.5 82.93,58.5 arc45 82.03,58.13 77.17,53.27 arc-45 76.27,52.9 75.53,52.9 arc45 74.63,52.53 70.77,48.67 arc-45 69.87,48.3 26.93,48.3 arc-45 26.03,48.67 20.77,53.93 arc-45 20.4,54.83 20.4,62.57 arc-45 20.77,63.47 22.13,64.83 arc-45 23.03,65.2 IC3.57
BUZZ  (via drill 0.5)
  Top 0.2: v16.2,67.7 19,67.7 19.4,67.3 21.6,67.3 21.8,67.1 22.2,67.1 v23.2,66.1
  Bottom 0.2: R26.2 12.4,83.7 11.6,82.9 11.6,81.3 12.4,80.5 13.2,80.5 13.8,79.9 13.8,68.5 14.6,67.7 v16.2,67.7 | 23.4,66.1 v23.2,66.1 23.3,66.2 IC3.59
CC_HIB  (via drill 0.5)
  Top 0.15: 46.4,47.57 v46.4,45.7
  Top 0.2: 46.4,47.57 46.4,47.62 arc45 46.2,48.1 arc45 45.72,48.3 44.2,48.3 arc-45 43.52,48.58 43.4,48.7 arc-45 43.2,49.18 43.2,51.7 v43,51.9
  Bottom 0.2: IC6.4 99.01,71.09 98.8,71.3 94.28,71.3 arc45 93.8,71.1 arc45 93.6,70.62 93.6,65.23 arc-45 93.23,64.33 89.37,60.47 arc-45 88.47,60.1 85.08,60.1 arc45 84.6,59.9 arc-45 84.12,59.7 82.33,59.7 arc45 81.43,59.33 76.57,54.47 arc-45 75.67,54.1 72.53,54.1 arc45 71.63,53.73 70.57,52.67 arc-45 69.67,52.3 62.33,52.3 arc45 61.43,51.93 61.37,51.87 arc-45 60.47,51.5 43.4,51.5 v43,51.9 | IC3.63 23.7,68.2 23.2,67.7 23.2,67.3 22.4,66.5 22.4,66.23 arc-45 22.03,65.33 20.37,63.67 arc45 20,62.77 20,54.63 arc45 20.37,53.73 22.63,51.47 arc-45 23,50.57 23,47.9 23.4,47.5 23.4,44.7 23.6,44.5 24.8,44.5 26.4,46.1 28.2,46.1 29.4,44.9 45.6,44.9 v46.4,45.7
CC_IRQ  (via drill 0.5)
  Top 0.2: v85.4,63.3 85.4,65.5 v85.6,65.7 | v78.8,72.1 v81.2,72.1 | v59.6,77.3 59.63,77.33 arc-45 60.53,77.7 64.6,77.7 64.8,77.9 68,77.9 v68.2,77.7
  Bottom 0.2: v85.4,63.3 89.2,63.3 91.23,65.33 arc45 91.6,66.23 91.6,71.9 93,73.3 106.9,73.3 107.5,72.7 107.5,71.1 107.9,70.7 IC6.11 | v78.8,72.1 70.6,72.1 68,74.7 68,77.5 v68.2,77.7 | IC3.3 41.77,73.2 arc45 42.67,73.57 44.83,75.73 arc-45 45.73,76.1 52.47,76.1 arc45 53.37,76.47 53.66,76.76 arc-45 54,76.9 58.8,76.9 arc45 59.48,77.18 v59.6,77.3 | v81.2,72.1 83.6,72.1 85.6,70.1 85.6,65.9 v85.6,65.7
CC_RST  (via drill 0.5)
  Top 0.2: v74.2,50.5 74.2,59.5 v74,59.7 | v54,77.9 54.2,78.1 64.4,78.1 64.6,78.3 67.2,78.3 v67.6,78.7 | v78.8,70.9 v81.2,70.9
  Bottom 0.2: S8.1 70.4,65.95 70.4,64.9 73.2,62.1 73.2,60.5 v74,59.7 74,59.3 74.4,58.9 75.6,58.9 80,63.3 80,64.7 | IC6.35 105.38,52.68 104.6,51.9 98.4,51.9 97.4,50.9 89,50.9 87.8,49.7 80.4,49.7 80,49.3 75.8,49.3 75.4,49.3 v74.2,50.5 | IC3.2 41.67,73.7 arc45 42.57,74.07 44.63,76.13 arc-45 45.53,76.5 52.27,76.5 arc45 53.17,76.87 53.72,77.42 arc45 v54,77.9 | v78.8,70.9 78,71.7 70.4,71.7 67.6,74.5 67.6,77.1 67.2,77.5 67.2,78.3 v67.6,78.7 | v81.2,70.9 80.8,70.5 80.8,68.9 80,68.1 80,64.7 | TP20.TP 80.2,64.5 80,64.7
D_N
  Bottom 0.2: IC3.70 22.6,71.7 21,70.1 21,67.5 20.4,66.9 20.4,66.1 19,64.7 18.2,63.9 17.6,63.3 R23.1
D_P
  Bottom 0.2: IC3.71 22.5,72.2 20.6,70.3 20.6,67.7 20,67.1 20,66.3 18.9,65.2 18.4,64.7 18.2,64.5 R25.1
DFGFDG
  Bottom 0.2: IC3.22 41,63.7 | IC3.21 40.5,64.2 41,63.7 | 41,63.7 42,63.7 44.27,61.43 C16.2 C15.2 48.38,61.43 L3.2
FET_OUT  (via drill 0.5)
  Top 0.813: OUTLINE1.FET 10.6,103.09 v10.6,98.1 8,98.1 7.4,97.5 7.4,96.37 LED1.K
  Bottom 0.2: 10.55,96.1 Q3.1 10.55,98.05 v10.6,98.1 | Q3.2 11.2,96.1 | Q3.6 10.55,96.1 | 10.55,96.1 Q3.EP1 11.2,96.1 | Q3.5 11.2,96.1
  pour Bottom (isolate 0.254): 12,95.3 12,98.5 11.2,99.3 10,99.3 9.6,98.9 9.6,94.9 11.6,94.9
FS_VUSB
  Bottom 0.2: R10.1 20.4,51.18 20.4,52.1 arc45 20.12,52.78 19.57,53.33 arc-45 19.2,54.23 19.2,63.17 arc-45 19.57,64.07 20.43,64.93 arc45 20.8,65.83 20.8,66.7 21.4,67.3 21.4,69.9 22.6,71.1 23.4,71.1 23.8,70.7 IC3.68
FSMC_A23
  Bottom 0.2: IC3.1 41.57,74.2 arc45 42.47,74.57 44.43,76.53 arc-45 45.33,76.9 49.92,76.9 R24.2
GND  (via drill 0.38, 0.5)
  Top 0.2: v76.8,67.7 77.2,67.7 | v23.2,61.3 23.6,61.3
  Top 0.305: v19.4,76.3 19.4,76.1
  Top 1.27: OUTLINE1.GND 114,97.9
  Bottom 0.2: C22.1 41.75,69.35 41.4,69.7 IC3.10 39,69.7 v38.6,69.3 | IC3.27 37.7,59.6 38,59.3 38.9,59.3 39.62,58.58 C12.1 39.62,57.48 v39.8,57.3 | J1.GND 12.8,50.1 12.4,50.5 12.4,52.1 13.22,52.1 IC1.3 | C15.1 C16.1 45.12,63.2 v43.8,63.2 43.3,63.2 42.08,64.43 C19.1 41.83,64.7 IC3.20 39,64.7 v38.6,65.1 | Q8.EP2 Q8.4 67.45,101.55 v66.8,100.9 | IC3.99 37.7,77.1 37.33,77.47 C39.1 C8.1 arc45 37.45,79.75 38.4,80.7 38.76,80.7 arc45 v39,80.8 | Q3.4 Q3.EP2 11.85,94.35 11.6,94.1 v11.2,94.1 | 33.85,96.75 IC2.3 33.85,97.95 34,98.1 35.3,98.1 C5.2 | R9.2 31.2,101.78 31.2,101.7 32,100.9 IC4.3 IC4.EP | IC4.7 35.7,101.4 IC4.EP | 35.2,101.7 IC4.EP | IC4.EP 35.2,100.1 | IC2.2 33.35,96.75 | v28.8,97.5 v29.6,97.5 | 29.8,97.5 v29.6,97.5 | v29.6,96.7 v29.6,97.5 | R15.2 46.62,90.83 v46.2,90.4 | S8.2 76.55,67.45 v76.8,67.7 | J2.43 63.55,76.15 v63.8,75.9 | 18.4,46.1 J1.SHIELD@3 | X2.4 51,67.68 X2.2 49.73,67.68 v49.2,68.2 48.9,68.5 C21.1 | 17.2,81.3 U1.GND1 16.4,80.7 v15.8,80.1 | U1.GND2 v7.6,64.85 | C11.1 23.23,61.28 v23.2,61.3 | C2.1 25.68,55.5 | 25.6,55.3 C2.1 | C2.1 26,55.3 | SG1.P$2 1,91 v1.2,91.2 | C33.1 53.9,72.4 v53.8,72.5 | v55.5,69 54.8,69.7 54.4,69.7 | 54.4,69.7 52.8,69.7 | C20.1 54.4,69.7 | v24.2,48.3 R5.2 | R11.1 32.65,54.35 33.2,53.8 v33.2,53.3 | v61,101.1 61.05,101.05 | C18.1 51.8,61.9 v52,61.7 | v34,55.7 C13.1 | U1.GND5 v4.8,66.5 | U1.GND7 v4.8,81.15 | U1.GND3 v7.6,82.9 | C45.1 58.3,74.3 v57.6,75 58.3,75.7 C38.1 | C24.1 51.9,71.3 v52,71.4 | R4.2 v57.35,71.38 | v53.3,91.1 52.23,91.1 R22.2 | 40.88,89.62 R16.2 41.17,89.6 v40.1,89.6 | v24.4,90.15 24.11,89.86 R33.1 | v61.05,73.15 J2.49 | J2.48 61.55,73.65 v61.05,73.15 | J2.50 61.55,72.65 v61.05,73.15
  Bottom 0.2: JP4.5 26.61,96.09 v26.2,96.5 | C23.1 45.02,71.43 v45,71.4 | R50.2 56.4,96.7 | 56.4,96.7 56.4,95.78 R28.2 | v55.5,96.7 56.4,96.7 | C17.1 12.8,82.3 v12.4,81.9 | IC9.12 58.75,65.85 59.1,66.2 | 59.1,66.2 59.75,66.85 IC8.1 | IC9.3 57.55,62.25 v57.2,61.9 | IC8.6 64,64.9 64.4,64.5 64.6,64.5 | 64.6,64.5 65,64.5 65.2,64.3 65.2,63.78 C36.2 | IC8.7 64.5,64.6 64.6,64.5 | v60.7,58.9 60.23,58.43 C42.2 C41.2 C40.2 55.33,58.43 v55.3,58.4 | C35.2 66.6,67.5 v66.2,67.9 | v58.8,66.5 59.1,66.2
  Bottom 0.254: S5.2 61.05,101.05 | Q4.4 51.45,95.05 51.6,94.9 52.4,94.9 v52.8,95.3 | v52.8,95.3 v52.8,96.1 | v53.6,95.3 v52.8,95.3
  Bottom 0.305: U1.GND4 19.05,77.65 19.4,77.3 v19.4,76.3
  Bottom 0.406: C36.2 65.28,62.98 v64.9,62.6 | C29.1 21.73,79.83 v22.3,80.4
  Bottom 0.813: R6.2 29.12,102.45 C1.1 R9.2 | C3.1 v41.4,103.1 | R13.2 v39.6,103.65
  other vias: 37.4,97.8 61,94.7 23,73.3 10.6,50.9 11.4,54.9 12.6,56.9 12.6,58.9 16.2,61.5 16.2,59.5 17.6,52.3 17.6,50.9 36.1,91.9 37.4,89.9 37.4,90.9 67.6,100.9 67.2,100.1 26.2,53.4 82.8,56.2 84,56.2 85.2,56.2 86.2,56.2 87.2,56.2 25.5,54.1 109.8,51.7 115,52.1 116.2,52.1 116.6,54.5 116.4,70.1 104.72,64.8 109.6,72.1 113.2,72.1 116.4,68.1 116.4,66.1 116.4,61.7 116.4,57.3 21.4,73.7 19.8,72.1 15.4,71.7 15.8,69.7 18.6,66.1 12.6,62.7 12.6,60.9 17.8,62.1 17.4,57.3 12.6,64.7 11.4,53.1 37.4,96.9 116.4,72.1 17.4,55.3 113.8,51.3 113.8,49.7 113.8,48.1 113.2,44.5 111.8,51.1 37,102.95 35.8,102.95 34.6,102.95 33.4,102.95 61,89.65 32.8,96.5 34.4,96.5 34.8,102.1 35.6,102.1 35.6,99.9 34.8,99.9 34,103.75 35.2,103.75 36.4,103.75 111.8,49.7 111.8,46.4 105.8,51.7 107.8,51.7 20.4,44.9 107.72,64.8 101.72,64.8 98.72,64.8 104.72,61.8 101.72,61.8 98.72,61.8 98.72,58.8 101.72,58.8 104.72,58.8 107.72,58.8 107.72,61.8 107.72,67.8 104.72,67.8 101.72,67.8 98.72,67.8 98.72,55.8 101.72,55.8 104.72,55.8 107.72,55.8 110.72,55.8 110.72,58.8 110.72,61.8 110.72,64.8 110.72,67.8 94,52.95 96.5,68.7 61,86.15 111.8,48.1 113.9,45.6
  pour Bottom (isolate 0.254): 21.1,51.3 18.9,54.1 19.2,59.2 19.2,59.6 20.5,60.9 19.3,68.1 22.3,69.9 25.4,69.9 26.1,70.6 26.1,74 25.3,74.8 15.1,74.8 11.8,71.1 11.6,67.9 11.6,56.5 9.9,54.6 9.9,51.2 8.7,50 8.7,43.3 20.9,43.1
  pour Bottom (isolate 0.254): 82,57.7 88.4,57.7 88.4,52.9 88,52.5 80.4,52.5 80,52.9 80,55.3 80.4,55.7
  pour Bottom (isolate 0.254): 94.4,74.5 119.6,74.5 119.6,43.7 111.4,43.7 111.4,51.3 92.8,51.3 90,54.1 90,71.3
  pour Top (isolate 0.254): 119.6,43.7 119.6,96.7 arc25 80,106.9 39.6,106.9 arc25 0,96.7 0,43.3 87.8,43.3 87.8,51.3 111.4,51.3 111.4,43.7
  pour Bottom (isolate 0.254): 23.2,57.3 26.4,57.3 26.8,56.9 26.8,55.3 27.2,54.9 27.2,53.3 26,52.1 25.6,52.1 22.8,54.9 22.8,56.9
  pour Bottom (isolate 0.254): 32,99.3 38.4,99.3 39.2,100.1 39.2,104.1 38.4,104.9 31.2,104.9 31.2,101.3 31.6,100.9
  pour Bottom (isolate 0.254): 28.8,98.9 38,98.9 38.4,98.5 38.4,88.9 38.8,88.5 32.4,88.5 28.8,92.1 28.8,95.7 27.6,96.9 27.6,97.7
  pour Bottom: 63.1,95.4 60.4,95.4 60.4,85.4 63.1,85.4
I2C_SCL  (via drill 0.5)
  Top 0.2: JP2.4 47.58,52.19 arc45 47.21,53.09 45.6,54.7 v45.6,54.9 | v14.2,99.3 14.8,99.3 15,99.5 15,100.9 16.2,102.1 19.6,102.1 22,104.5 OUTLINE1.SCL | v3,85.3 1.4,85.3 1.2,85.1 1.2,52.9 4.4,49.7 5,49.7 8.6,46.1 22.4,46.1 v22.6,45.9
  Bottom 0.2: IC3.95 35.7,75 36.2,74.5 37.6,74.5 38,74.1 38,70.5 37.4,69.9 37.4,64.5 38,63.9 38,62.1 38.8,61.3 38.8,60.5 39.2,60.1 40,60.1 45.2,54.9 v45.6,54.9 | v14.2,99.3 14.6,99.3 15.2,98.7 15.2,97.3 14,96.1 14,93.3 12.4,91.7 10.8,91.7 6.6,87.5 4.6,87.5 4,86.9 4,85.9 3.6,85.5 3.2,85.5 v3,85.3 | v22.6,45.9 22.6,44.9 23.4,44.1 25,44.1 26.6,45.7 28,45.7 29.2,44.5 46.8,44.5 47.6,45.3 47.6,46.88 JP2.4
I2C_SDA  (via drill 0.5)
  Top 0.2: v46.8,54.7 46.8,54.5 arc45 47.08,53.82 47.63,53.27 arc-45 48,52.37 48,49.55 arc45 48.37,48.65 JP2.3 | OUTLINE1.SDA 15.84,102.54 14.4,101.1 14.4,100.3 14.2,100.1 13.4,100.1 13,99.7 v13,99.1 | v3,86.5 2.2,85.7 1.2,85.7 0.8,85.3 0.8,52.7 4.2,49.3 4.8,49.3 8.4,45.7 21.6,45.7 22.6,44.7 26.6,44.7 26.8,44.9 v27.2,44.9
  Bottom 0.2: IC3.96 36.2,75.1 36.4,74.9 37.8,74.9 38.4,74.3 38.4,70.3 37.8,69.7 37.8,64.7 38.4,64.1 38.4,62.3 39.2,61.5 39.2,60.7 39.4,60.5 40.2,60.5 45,55.7 45.8,55.7 arc-45 46.48,55.42 46.6,55.3 arc-45 46.8,54.82 v46.8,54.7 | v13,99.1 13,98.9 13.4,98.5 14.6,98.5 14.8,98.3 14.8,97.5 13.6,96.3 13.6,93.5 12.2,92.1 10.6,92.1 6.4,87.9 4.4,87.9 3.6,87.1 3.6,86.7 3.4,86.5 v3,86.5 | v27.2,44.9 27.4,44.9 28.2,44.1 49,44.1 50,45.1 50,46.78 JP2.3
IMU_IRQ1
  Bottom 0.2: IC3.17 44.3,66.2 45,65.5 52.4,65.5 52.8,65.1 52.8,62.7 53.4,62.1 TP1.TP
IMU_IRQ2  (via drill 0.5)
  Top 0.2: v61.8,65.1 61.8,68.1 v61.4,68.5
  Bottom 0.2: IC3.7 42.17,71.2 arc45 43.07,71.57 45.63,74.13 arc-45 46.53,74.5 51.47,74.5 arc-45 52.03,74.27 52.2,74.1 arc-45 52.4,73.62 52.4,72.9 arc45 52.68,72.22 52.83,72.07 arc45 53.73,71.7 54.8,71.7 55.2,71.3 55.2,70.5 56.8,68.9 56.8,68.7 57.4,68.1 61,68.1 v61.4,68.5 | IC8.4 62.05,65.35 v61.8,65.1
IMU_SCL
  Bottom 0.2: IC3.15 44.5,67.2 45.4,66.3 54.92,66.3 R19.2 55.2,66.9 TP19.TP 56.2,67.5 56.4,67.5 56.6,67.7 61.8,67.7 62.2,68.1 63.8,68.1 64,67.9 IC8.13
IMU_SDA
  Bottom 0.2: IC3.16 44.4,66.7 45.2,65.9 53.08,65.9 R18.2 53.88,65.38 54.2,65.7 56.4,65.7 TP18.TP 58,67.3 62,67.3 62.4,67.7 63.4,67.7 63.5,67.6 IC8.14
JOY_DWN  (via drill 0.5)
  Top 0.2: v25.8,65.9 v25.8,68.3 | v26.6,74.5 26.5,74.5 SW1.D
  Bottom 0.2: IC3.58 25.6,65.7 v25.8,65.9 | v25.8,68.3 26.8,69.3 27.6,69.3 28,69.7 28,73.1 v26.6,74.5
JOY_LEFT  (via drill 0.5)
  Top 0.2: SW1.B v26.6,78
  Bottom 0.2: IC3.77 26.7,77.9 v26.6,78
JOY_RIGHT  (via drill 0.5)
  Top 0.2: SW1.C 17.4,83.6 17.4,85.3 19.6,87.5 21,87.5 21.6,86.9 21.6,86.07 v21.87,85.8
  Bottom 0.2: IC3.84 30.2,76.97 arc-45 30.57,77.87 arc45 30.8,78.42 30.8,79.97 arc45 30.43,80.87 30,81.3 29,81.3 28.6,81.7 28.6,83.5 27.8,84.3 26.6,84.3 24.4,86.5 22.2,86.5 21.87,86.17 v21.87,85.8 21.74,85.93 21.6,85.93 21.6,85.9
JOY_UP  (via drill 0.5)
  Top 0.2: v33,79.5 v33,82.3 | v20.6,85.7 20.6,85.66 SW1.A
  Bottom 0.2: 33,81.9 v33,82.3 32.2,81.5 30.4,81.5 30.2,81.7 29.2,81.7 29,81.9 29,83.7 28,84.7 26.8,84.7 24.6,86.9 21.8,86.9 v20.6,85.7 | v33,79.5 33,78.5 32.07,77.57 arc45 31.7,76.67 IC3.87
LCD0  (via drill 0.5)
  Top 0.2: v32,73.9 32.4,73.9 33.4,74.9 34.2,74.9 34.6,75.3 36.2,75.3 38.2,77.3 38.8,77.3 39.6,78.1 39.6,78.7 40,79.1 41,79.1 v41.2,79.3 | 57.2,83.1 57.6,83.1 v57.4,82.9 56.77,83.53 arc45 55.87,83.9 54.53,83.9 arc-45 53.63,84.27 52.97,84.93 arc45 52.07,85.3 51.8,85.3 arc45 51.12,85.02 49.77,83.67 arc-45 48.87,83.3 48.53,83.3 arc45 47.63,82.93 47.2,82.5 v47.2,82.1
  Bottom 0.2: J2.32 58.85,81.65 58.4,82.1 58.4,82.5 58,82.9 v57.4,82.9 | v32,73.9 32.4,73.5 32.4,72.7 32.2,72.5 32,72.5 31.6,72.1 31.6,71.1 27.6,67.1 25.2,67.1 25.1,67.2 IC3.61 | v41.2,79.3 41.23,79.33 arc-45 42.13,79.7 44,79.7 arc57 46.2,80.9 46.83,81.53 arc45 47.2,82.43 v47.2,82.1
LCD1  (via drill 0.5)
  Top 0.2: 55.8,83.1 v56,83.1 55.97,83.13 arc45 55.07,83.5 54.33,83.5 arc-45 53.43,83.87 52.68,84.62 arc45 52,84.9 arc45 51.32,84.62 49.97,83.27 arc-45 49.07,82.9 48.68,82.9 arc45 48.2,82.7 arc45 48,82.22 v48,81.1 | v31.2,72.9 32.6,72.9 32.8,73.1 32.8,73.7 33.6,74.5 34.4,74.5 34.8,74.9 36.4,74.9 38.4,76.9 39,76.9 v40.4,78.3
  Bottom 0.2: J2.31 59.15,82.15 58.8,82.5 58.8,83.1 58.2,83.7 57.13,83.7 arc45 56.23,83.33 v56,83.1 | v40.4,78.3 40.6,78.1 41,78.5 42.27,78.5 arc45 43.17,78.87 43.23,78.93 arc-45 44.13,79.3 44.2,79.3 arc48 46,80.1 46.63,80.73 arc-45 47.53,81.1 v48,81.1 | v31.2,72.9 31.2,71.3 27.4,67.5 25.4,67.5 25.2,67.7 IC3.62
LCD2  (via drill 0.5)
  Top 0.2: v29.4,80.1 29.4,82.3 v30.6,83.5 | v60,87.3 60.4,87.7 v64.8,87.7
  Bottom 0.2: 64.4,87.7 v64.8,87.7 64,87.7 63.8,87.5 63.8,83.38 arc-45 63.6,82.9 arc-45 62.6,82.65 J2.30 | v30.6,83.5 30.63,83.47 arc45 31.53,83.1 33.67,83.1 arc45 34.57,83.47 35.23,84.13 arc-45 36.13,84.5 41.12,84.5 arc45 41.6,84.7 41.83,84.93 arc-45 42.73,85.3 54.32,85.3 arc45 54.8,85.5 arc-45 55.28,85.7 57.87,85.7 arc45 58.77,86.07 v60,87.3 | v29.4,80.1 28.8,79.5 28.8,76.9 28.7,76.8 IC3.81
LCD3  (via drill 0.5)
  Top 0.2: v29.6,78.7 30.2,79.3 30.2,81.9 30.6,82.3 v30.8,82.3 | v59.6,88.5 v63.8,88.5
  Bottom 0.2: v59.6,88.5 59.4,88.3 arc45 59.2,87.82 59.2,87.5 arc-45 58.92,86.82 58.57,86.47 arc-45 57.67,86.1 55.08,86.1 arc45 54.6,85.9 arc-45 54.12,85.7 42.53,85.7 arc45 41.63,85.33 41.57,85.27 arc-45 40.67,84.9 35.93,84.9 arc45 35.03,84.53 34.37,83.87 arc-45 33.47,83.5 32.33,83.5 arc-45 31.43,83.87 31.14,84.16 arc45 30.8,84.3 30.48,84.3 arc45 30,84.1 arc45 29.8,83.62 29.8,82.7 29.92,82.58 arc45 v30.8,82.3 | 64,88.5 v63.8,88.5 63.6,88.5 63.4,88.3 63.4,83.5 arc-90 63.05,83.15 J2.29 | v29.6,78.7 29.2,78.3 IC3.82
LCD4  (via drill 0.5)
  Top 0.2: v41.8,75.1 42,75.1 41.2,74.3 40,74.3 39.8,74.1 38.6,74.1 37.4,72.9 36.4,72.9 v36,72.5 | v51.2,79.7 51.2,80.37 arc-45 51.57,81.27 51.63,81.33 arc-45 52.53,81.7 53.92,81.7 arc45 54.4,81.9 54.66,82.16 arc45 v54.8,82.5
  Bottom 0.2: IC3.38 32.2,61.9 32,62.1 32,68.5 33.6,70.1 35,70.1 36,71.1 36,72.1 36.2,72.3 v36,72.5 | J2.28 58.85,83.65 58.4,84.1 56.33,84.1 arc45 55.43,83.73 55.17,83.47 arc45 54.8,82.57 v54.8,82.5 | v51.2,79.7 50.4,79.7 50,79.3 50,78.83 arc-45 49.63,77.93 49.37,77.67 arc-45 48.47,77.3 45.13,77.3 arc45 44.23,76.93 42.77,75.47 arc-45 41.87,75.1 v41.8,75.1
LCD5  (via drill 0.5)
  Top 0.2: v35.2,71.7 35,71.9 35.2,72.1 35.2,72.9 35.6,73.3 37.2,73.3 38.4,74.5 39.6,74.5 40.2,75.1 v40.4,75.1 | v53.6,82.5 51.73,82.5 arc45 50.83,82.13 50.77,82.07 arc45 50.4,81.17 v50.4,80.5
  Bottom 0.2: IC3.39 31.7,61.6 31.6,61.7 31.6,68.7 33.4,70.5 34.4,70.5 35.2,71.3 v35.2,71.7 | J2.27 58.95,84.15 58.6,84.5 56.13,84.5 arc45 55.23,84.13 v53.6,82.5 | v50.4,80.5 50,80.5 49.6,80.1 49.6,79.03 arc-45 49.23,78.13 49.17,78.07 arc-45 48.27,77.7 44.93,77.7 arc45 44.03,77.33 43.17,76.47 arc-45 42.27,76.1 41.6,76.1 40.6,75.1 v40.4,75.1
LCD6  (via drill 0.5)
  Top 0.2: v34.4,72.9 34.6,72.9 35.4,73.7 37,73.7 38.6,75.3 v39.2,75.3 | v52.8,83.3 51.73,83.3 arc45 50.83,82.93 49.88,81.98 arc45 v49.6,81.3
  Bottom 0.2: J2.26 59.05,84.65 58.8,84.9 55.93,84.9 arc45 55.03,84.53 54.17,83.67 arc-45 53.27,83.3 v52.8,83.3 | IC3.40 31.2,68.9 33.6,71.3 34,71.3 34.4,71.7 v34.4,72.9 | v39.2,75.3 39.4,75.3 40,75.9 40.8,75.9 41.4,76.5 42.07,76.5 arc45 42.97,76.87 43.83,77.73 arc-45 44.73,78.1 48.07,78.1 arc45 48.97,78.47 49,78.5 arc45 49.2,78.98 49.2,80.9 v49.6,81.3
LCD7  (via drill 0.5)
  Top 0.2: v33.6,72.1 33.6,73.3 34,73.7 34.8,73.7 35.2,74.1 36.8,74.1 38.8,76.1 39.8,76.1 v40.4,76.7 | v48.8,82.1 48.87,82.1 arc45 49.77,82.47 51.2,83.9 arc-45 51.68,84.1 v52,84.1
  Bottom 0.2: IC3.41 30.7,61.6 30.8,61.7 30.8,69.1 33.6,71.9 v33.6,72.1 | J2.25 59.15,85.15 59,85.3 55.73,85.3 arc45 54.83,84.93 54.37,84.47 arc-45 53.47,84.1 v52,84.1 | v40.4,76.7 41,76.7 41.2,76.9 41.87,76.9 arc45 42.77,77.27 43.63,78.13 arc-45 44.53,78.5 48.12,78.5 arc45 48.6,78.7 arc45 48.8,79.18 v48.8,82.1
LCD_!RST  (via drill 0.5)
  Top 0.2: v32.4,71.7 32.8,72.1 32.8,72.5 33.2,72.9 33.2,73.5 33.8,74.1 34.6,74.1 35,74.5 36.6,74.5 38.6,76.5 39.2,76.5 40.2,77.5 41.4,77.5 v41.6,77.7 | v64.6,79.5 63.97,78.87 arc-45 63.07,78.5 56.48,78.5 arc-45 56,78.7 arc-45 55.8,79.18 55.8,79.9 arc45 55.52,80.58 55.17,80.93 arc45 54.27,81.3 52.68,81.3 arc45 52.2,81.1 arc45 52,80.62 52,79.58 arc-45 51.8,79.1 arc-45 51.32,78.9 51.2,78.9 arc-45 50.52,79.18 49.48,80.22 arc45 48.8,80.5 arc45 48.46,80.36 v48,79.9 | v66,89.7 66,89.9 66.45,90.35 v66.45,94.3
  Bottom 0.2: v32.4,71.7 32,71.3 32,70.9 27.8,66.7 IC3.60 | v41.6,77.7 42.07,77.7 arc45 42.97,78.07 43.43,78.53 arc-45 44.33,78.9 44.4,78.9 arc48 46.2,79.7 46.43,79.93 arc-45 47.33,80.3 47.6,80.3 v48,79.9 | v66,89.7 66.4,89.3 66.4,87.43 arc-45 66.03,86.53 65.37,85.87 arc45 65,84.97 65,82.83 arc-45 64.63,81.93 64.57,81.87 arc45 64.2,80.97 64.2,79.98 arc45 64.4,79.5 64.52,79.38 arc45 v64.6,79.5 | J2.10 63.25,92.65 64.9,94.3 v66.45,94.3
LCD_CS  (via drill 0.5)
  Top 0.2: v43,83.7 42.6,83.3 42.6,81.5 v42.8,81.3
  Bottom 0.2: v42.8,81.3 43.2,81.7 44.07,81.7 arc45 44.97,82.07 45.83,82.93 arc-45 46.73,83.3 48.87,83.3 arc-45 49.77,82.93 52.63,80.07 arc45 53.53,79.7 54,79.7 54.2,79.5 54.2,78.9 55,78.1 60.4,78.1 60.95,78.65 J2.38 | IC3.88 32.2,76.57 arc-45 32.57,77.47 33.43,78.33 arc45 33.8,79.23 33.8,80.37 arc-45 34.17,81.27 35.83,82.93 arc-45 36.73,83.3 42.6,83.3 v43,83.7
LCD_MODE  (via drill 0.5)
  Top 0.2: v63.7,94.3 65.4,94.3 66.1,93.6 66.1,91.4 v65.2,90.5 | v65.2,74.1 60.8,74.1 v59.8,73.1
  Bottom 0.2: 63.45,93.65 63.7,93.9 v63.7,94.3 63.55,94.15 J2.7 | v65.2,74.1 65.4,74.3 65.4,76.7 64.17,77.93 arc-45 63.8,78.83 63.8,81.17 arc-45 64.17,82.07 64.23,82.13 arc45 64.6,83.03 64.6,85.17 arc-45 64.97,86.07 65.63,86.73 arc45 66,87.63 66,87.77 arc45 65.63,88.67 65.4,88.9 arc-45 65.2,89.38 v65.2,90.5 | IC3.5 41.97,72.2 arc45 42.87,72.57 45.23,74.93 arc-45 46.13,75.3 51.87,75.3 arc-45 52.77,74.93 53.63,74.07 arc45 54.53,73.7 57.4,73.7 58,73.1 v59.8,73.1 | 63.45,93.65 J2.8 | J2.9 63.25,93.15 63.45,93.35 63.45,93.65
LCD_RD  (via drill 0.5)
  Top 0.2: v56.6,79.3 56.6,80.17 arc45 56.23,81.07 v55.6,81.7
  Bottom 0.2: IC3.85 30.7,76.87 arc-45 31.07,77.77 31.43,78.13 arc45 31.8,79.03 31.8,79.57 arc-45 32.17,80.47 35.43,83.73 arc-45 36.33,84.1 41.07,84.1 arc45 41.97,84.47 42.03,84.53 arc-45 42.93,84.9 49.67,84.9 arc-45 50.57,84.53 53.43,81.67 arc45 54.33,81.3 54.67,81.3 arc45 55.57,81.67 v55.6,81.7 | J2.35 57.4,80.15 arc45 56.8,79.9 arc45 56.6,79.42 v56.6,79.3
LCD_WRX  (via drill 0.5)
  Top 0.2: v57.8,79.3 57.2,79.9 arc-45 57,80.38 57,81.7 arc90 v56.8,81.9
  Bottom 0.2: J2.36 58.15,79.65 v57.8,79.3 | IC3.86 31.2,76.77 arc-45 31.57,77.67 31.83,77.93 arc45 32.2,78.83 32.2,79.37 arc-45 32.57,80.27 35.63,83.33 arc-45 36.53,83.7 41.27,83.7 arc45 42.17,84.07 42.23,84.13 arc-45 43.13,84.5 49.47,84.5 arc-45 50.37,84.13 53.23,81.27 arc45 54.13,80.9 55.72,80.9 arc45 56.2,81.1 56.66,81.56 arc45 v56.8,81.9
LED1
  Bottom 0.2: IC3.46 28.2,59.5 28.6,59.1 28.6,57.38 R12.2
LED2
  Bottom 0.2: IC3.43 29.7,59.8 29.8,59.7 29.8,58.23 R14.2
LEDK1
  Bottom 0.305: J2.2 67.22,96.65 arc45 68.12,97.02 69.23,98.13 arc45 69.6,99.03 R47.2
LEDK2
  Bottom 0.305: J2.3 67.52,96.15 arc45 68.42,96.52 70.83,98.93 arc45 71.2,99.83 R48.2
LEDK3
  Bottom 0.305: J2.4 67.82,95.65 arc45 68.72,96.02 72.43,99.73 arc45 72.8,100.63 R49.2
LEDK4
  Bottom 0.305: J2.5 68.12,95.15 arc45 69.02,95.52 74.03,100.53 arc45 74.4,101.43 R44.2
MOM_DWN  (via drill 0.5)
  Top 0.2: v85.4,58.9 86.2,59.7 86.2,63.3 87.6,64.7 89.4,64.7 89.8,65.1 89.8,76.9 92.8,79.9 92.8,82.12 S4.B2
  Bottom 0.2: v85.4,58.9 82.73,58.9 arc45 81.83,58.53 76.97,53.67 arc-45 76.07,53.3 75.33,53.3 arc45 74.43,52.93 70.57,49.07 arc-45 69.67,48.7 27.13,48.7 arc-45 26.23,49.07 21.17,54.13 arc-45 20.8,55.03 20.8,62.37 arc-45 21.17,63.27 22.23,64.33 arc-45 23.13,64.7 IC3.56
MOM_RIGHT  (via drill 0.5)
  Top 0.2: v87.8,59.3 87.6,59.3 87,59.9 87,62.9 88,63.9 89.8,63.9 90.6,64.7 90.6,76.5 95.2,81.1 95.2,85.5 99.97,90.28 S3.B2
  Bottom 0.2: v87.8,59.3 87.4,59.7 85,59.7 84.6,59.3 82.53,59.3 arc45 81.63,58.93 76.77,54.07 arc-45 75.87,53.7 75.13,53.7 arc45 74.23,53.33 70.37,49.47 arc-45 69.47,49.1 27.33,49.1 arc-45 26.43,49.47 21.57,54.33 arc-45 21.2,55.23 21.2,62.17 arc-45 21.57,63.07 22.33,63.83 arc-45 23.23,64.2 IC3.55
N$1
  Bottom 0.2: IC8.9 65.75,65.85 65.8,65.9 67.2,65.9 67.4,65.7 67.4,62.9 65.6,61.1 60.8,61.1 60.6,61.3 60.6,62.1 60.45,62.25 IC9.8
N$2
  Bottom 0.2: IC2.7 33.35,94.95 33.4,94.9
  Bottom 0.406: 33.4,94.9 33.4,94.7 32.4,93.7 32.4,93.3 L1.1
N$3
  Bottom 0.254: Q4.3 51.45,96.26 Q4.EP2 Q4.EP1 50.15,95.94 Q4.6
N$4
  Bottom 0.2: SG1.P$1 12.6,86.3 15.2,83.7 R26.1
N$5
  Bottom 0.2: IC3.19 43.08,65.2 C19.2 44.42,64.45 44.77,64.1 47.42,64.1 47.83,63.7 R8.1
N$6
  Bottom 0.2: Q1.4 46.15,91.45 46.4,91.7 46.4,92.9 | Q2.4 46.17,93.12 46.4,92.9 | R15.1 46.73,92.58 46.4,92.9
N$7
  Bottom 0.2: Q1.1 Q1.2 Q1.3 41.27,91.45 R16.1 40.92,91.38
N$8  (via drill 0.5)
  Top 0.2: LED5.C 22.15,48.95 22.4,48.7 22.4,47.5 21.4,46.5 8.8,46.5 6.4,48.9 6.4,49.15 v6.4,49.3
  Bottom 0.2: R2.2 7.2,48.5 v6.4,49.3
N$9  (via drill 0.5)
  Top 0.2: v4.6,50.5 4.6,50.1 1.6,53.1 1.6,84.1 v2,84.5
  Bottom 0.2: IC4.8 38.2,100.9 38.6,101.3 38.6,104.7 38,105.3 30.4,105.3 29.6,104.5 28.2,104.5 26.6,102.9 17.6,102.9 16.4,101.7 12.4,101.7 10.8,100.1 9.4,100.1 7.2,97.9 1.4,97.9 0.8,97.3 0.8,93.9 2.2,92.5 2.2,84.7 v2,84.5 | R2.1 6.67,46.43 6.4,46.7 6.4,47.9 5.2,49.1 5.2,49.9 v4.6,50.5
N$10
  Bottom 0.2: IC4.4 32.1,101.4 31.8,101.7 31.8,103.3 31.4,103.7 R6.1
N$11
  Bottom 0.2: IC4.2 30.82,100.4 R9.1
N$12
  Bottom 0.2: IC4.9 38.38,100.4 38.6,100.4 39.02,100.83 R13.1
N$13
  Bottom 0.2: IC7.5 54,100.1 54.2,100.3 54.4,100.3 54.8,100.7 54.8,101.22 C48.2 54.88,102.35 arc90 R51.1
N$15
  Bottom 0.2: 42.88,95.78 42.8,95.7 | R45.1 D3.C | Q1.5 44.4,90.5 44,90.9 44,94.08 Q2.EP
  Bottom 0.406: 43.2,96.1 42.88,95.78
  pour Bottom (isolate 0.254): 44.8,97.3 44.8,92.9 44.4,89.3 39.6,89.3 39.6,95.3 40.4,97.3
N$17
  Bottom 0.2: IC6.10 R27.1 106.12,72.2 TP11.TP
N$21
  Top 0.2: SV2.3 7.58,57.32 6,58.9 3.6,58.9 3.2,58.5 3.2,53.7 4.4,52.5 6.8,52.5 7.2,52.1 7.2,48.7 9,46.9 21.2,46.9 22,47.7 22,48.5 21.6,48.9 19.4,48.9 18.4,49.9 18.4,55.95 D1.2
N$22
  Bottom 0.2: IC9.4 57.4,60.9 56.6,60.9 56.4,60.7 C40.1
N$26
  Bottom 0.2: IC8.2 59.85,66.35 59.2,65.7 59.2,64.5 59.25,64.45 | IC9.11 59.25,64.45 | R30.2 61.52,63.78 60.8,64.5 59.3,64.5 59.25,64.45
N$27
  Bottom 0.406: J1.VBUS 15.4,50.5 15.2,50.7 15.2,53.18 | 15.2,53.18 IC1.5 | 15.2,53.18 15.2,53.3 16.1,54.2 L2.1
  Bottom 0.61: L2.1 16.3,55.53 C7.2
N$28
  Bottom 0.2: D2.C SJ1.1
N$29  (via drill 0.5)
  Top 0.2: v58,64.9 59.6,64.9 v60,65.3
  Bottom 0.2: IC9.1 58.22,64.68 v58,64.9 57.92,64.97 R31.2 | IC8.3 60.55,65.85 v60,65.3
N$31
  Bottom 0.2: IC3.12 41,68.7 41.6,68.1 45.92,68.1 C21.2 46.4,68.5 46.4,69.1 46.8,69.5 49.98,69.5 50,69.53 X2.3
N$33
  Bottom 0.2: C20.2 53.2,68.03 X2.1 52.85,67.15 52.4,66.7 49.1,66.7 48.7,67.1 R43.2
N$36
  Bottom 0.61: IC6.31 110.46,52.44 110.8,52.1 112.4,52.1 112.8,51.7 112.8,45.7 112.4,45.3 ANT1.P$1
N$37
  Bottom 0.2: IC3.49 26.7,59.6 26.6,59.5 26.2,59.5 25.8,59.1 25.4,59.1 24.65,58.35 24.7,58.4 24.57,58.28 C10.2
N$38
  Bottom 0.2: IC3.73 25.1,73.2 25.4,73.5 25.4,74.5 25,74.9 24.6,74.9 24.2,75.3 24.2,77.1 23.6,77.7 23.27,77.7 R7.2 C29.2
N$39
  Bottom 0.2: IC6.51 94.64,64.34 91.2,60.9 91.2,59.1 89.6,57.5 TP12.TP
N$41
  Bottom 0.2: IC6.23 116.3,60.53 R17.1
N$42
  Bottom 0.2: IC3.13 40.7,68.2 41.2,67.7 44.8,67.7 45.4,67.1 R43.1
N$43
  Bottom 0.2: IC6.21 116.3,63.07 R20.1
N$44
  Bottom 0.2: IC6.44 94.95,55.45 92.6,53.1 TP13.TP
N$50
  Bottom 0.2: IC7.2 54,97.1 54.73,96.38 R28.1 54.4,95.7
  Bottom 0.254: Q4.5 50.8,94.5 51.2,94.1 53.8,94.1 54.73,95.03 R28.1 | 54.4,95.7 54.4,95.9
N$51  (via drill 0.5)
  Top 0.2: v31.6,59.1 29.6,59.1 28.4,60.3 28.4,62.7 28.6,62.9 29.2,62.9 29.4,63.1 29.4,63.45 LED3.A
  Bottom 0.2: R14.1 31.88,58.83 v31.6,59.1
N$52  (via drill 0.5)
  Top 0.2: v27.8,58.3 28,58.5 LED2.A
  Bottom 0.2: R12.1 28.2,55.5 27.4,56.3 27.4,57.9 v27.8,58.3
N$54  (via drill 0.5)
  Top 0.2: v44,98.1 44,102.9 46,104.9 56,104.9 57,103.9 v57,102.1
  Bottom 0.2: Q6.4 38.85,96.78 R45.2 38.73,97.62 38.8,97.7 43.6,97.7 v44,98.1 | v57,102.1 57.3,102.1 S5.3
N$55
  Bottom 0.2: R29.1 52,98.33
  Bottom 0.254: IC7.3 52,98.33 51.42,98.33 50.8,97.7 Q4.2
N$57
  Bottom 0.2: IC7.4 53.5,99.8 53.2,100.1
  Bottom 0.406: Q4.1 50.15,98.35 | 48.1,98.9 JP3.1 | 52,100.5 51.2,100.5 49.6,98.9 | 53.2,100.1 52.4,100.9
  Bottom 0.813: 48,97.3 JP3.1 | C48.1 52.8,101.3 52.4,100.9 52,100.5 R29.2 | 48.1,98.9 49.6,98.9 50.15,98.35
N$60  (via drill 0.5)
  Top 0.406: v5.2,91.1 5.2,88.9 6.8,87.3 v6.8,86.7
  Bottom 0.305: v6.8,86.7 6.8,87.1 10.8,91.1 13.4,91.1 14,90.5 14,86.32 R1.1
  Bottom 0.406: LED1.A 4.93,91.37 v5.2,91.1
N$61
  Bottom 0.2: TP14.TP 91.8,55.7 92,55.5 93,56.5 93,60.1 93.43,60.53 IC6.48
N$63
  Bottom 0.254: IC7.6 56.3,99.47 R50.1
N$64
  Bottom 0.2: Q8.6 66.15,102.58 Q8.EP1 | Q8.5 66.8,102.58 Q8.EP1 | Q8.2 66.8,103.22 Q8.EP1 | Q8.1 66.15,103.22 Q8.EP1 | 66.8,104.5 66.8,104.7
  Bottom 0.305: Q8.2 66.8,104.5 66.2,104.5 66.2,103.7
  Bottom 0.61: R47.1 69.6,104.1 69,104.7 66.8,104.7 66.4,104.7
  Bottom 1.016: 71.2,104 70,104 69.78,103.78 R47.1 | 71.2,104 72.8,104 | 72.8,104 74.17,104 R44.1 | R49.1 72.8,104 | R48.1 71.2,104
N$65
  Bottom 0.2: IC6.49 93.5,61.8 92.6,60.9 92.6,57.5 92,56.9 90.8,56.9 90.4,56.5 90.4,55.3 TP15.TP
N$66
  Bottom 0.2: IC6.50 93.97,63.07 91.6,60.7 TP16.TP
N$67
  Bottom 0.2: IC6.52 94.71,65.61 94,64.9 94,64.5 89.6,60.1 TP17.TP
NRST  (via drill 0.5)